# EAGLE design BreakoutChip (EAGLE 7.1.0)

## Sheet 1 of 4
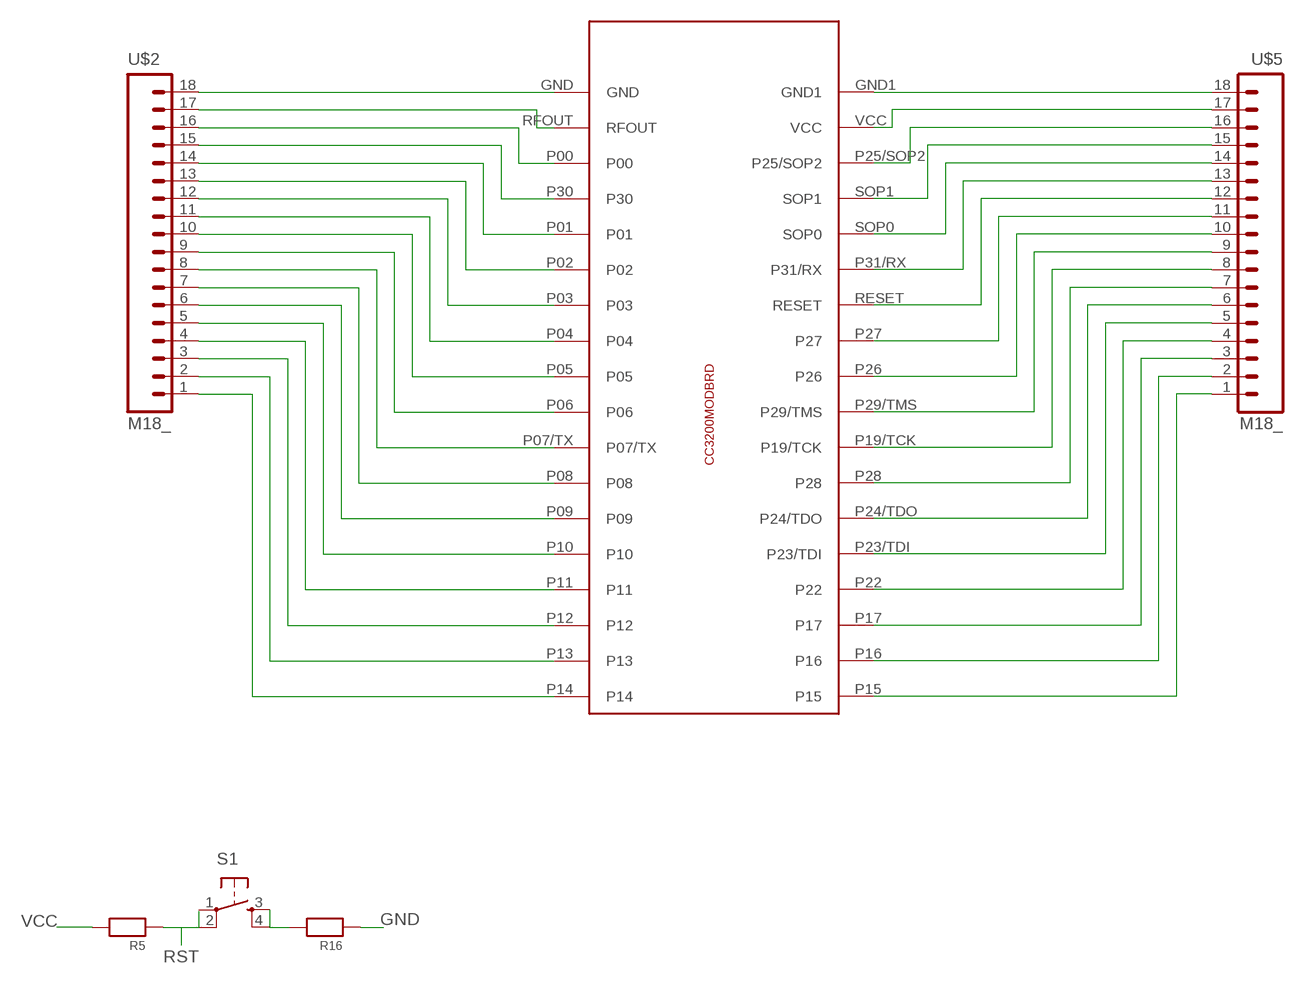
[diagram p0: schematic, sheet 1]

### Parts
R5  RESISTOR0402  [0402]
R16  RESISTOR0402  [0402]
S1  TAC_SWITCHSMD  [TACTILE_SWITCH_SMD]
U$1  CC3200MOD  [CC3200MOD]
U$2  M18_  [1X18]
U$5  M18_  [1X18]

### Nets
FTDI_RX: U$1.P01 U$2.14 ; also sheet 4
FTDI_TX: U$1.P02 U$2.13 ; also sheet 4
GND [vcc]: R16.1 U$1.GND U$1.GND1 U$2.18 U$5.18 ; also sheet 2,3,4
GPIO_05: U$1.P05 U$2.10 ; also sheet 2
N$1: R16.2 S1.3 S1.4
N$3: U$1.RFOUT U$2.17
N$4: U$1.P00 U$2.16
N$5: U$1.P30 U$2.15
N$9: U$1.P03 U$2.12
N$10: U$1.P04 U$2.11
N$13: U$1.P06 U$2.9
N$14: U$1.P07/TX U$2.8
N$15: U$1.P08 U$2.7
N$16: U$1.P09 U$2.6
N$17: U$1.P10 U$2.5
N$18: U$1.P11 U$2.4
N$19: U$1.P12 U$2.3
N$20: U$1.P13 U$2.2
N$21: U$1.P14 U$2.1
N$25: U$1.SOP1 U$5.15
N$26: U$1.SOP0 U$5.14
N$27: U$1.P31/RX U$5.13
N$29: U$1.P27 U$5.11
N$30: U$1.P26 U$5.10
N$31: U$1.P29/TMS U$5.9
N$32: U$1.P19/TCK U$5.8
N$33: U$1.P28 U$5.7
N$34: U$1.P24/TDO U$5.6
N$35: U$1.P23/TDI U$5.5
N$36: U$1.P22 U$5.4
N$37: U$1.P17 U$5.3
N$52: U$1.P16 U$5.2
N$53: U$1.P15 U$5.1
RST: R5.1 S1.2 U$1.RESET U$5.12 ; also sheet 4
SOP2: U$1.P25/SOP2 U$5.16 ; also sheet 4
VCC: R5.2 U$1.VCC U$5.17 ; also sheet 3,4
Unconnected: S1.1

## Sheet 2 of 4
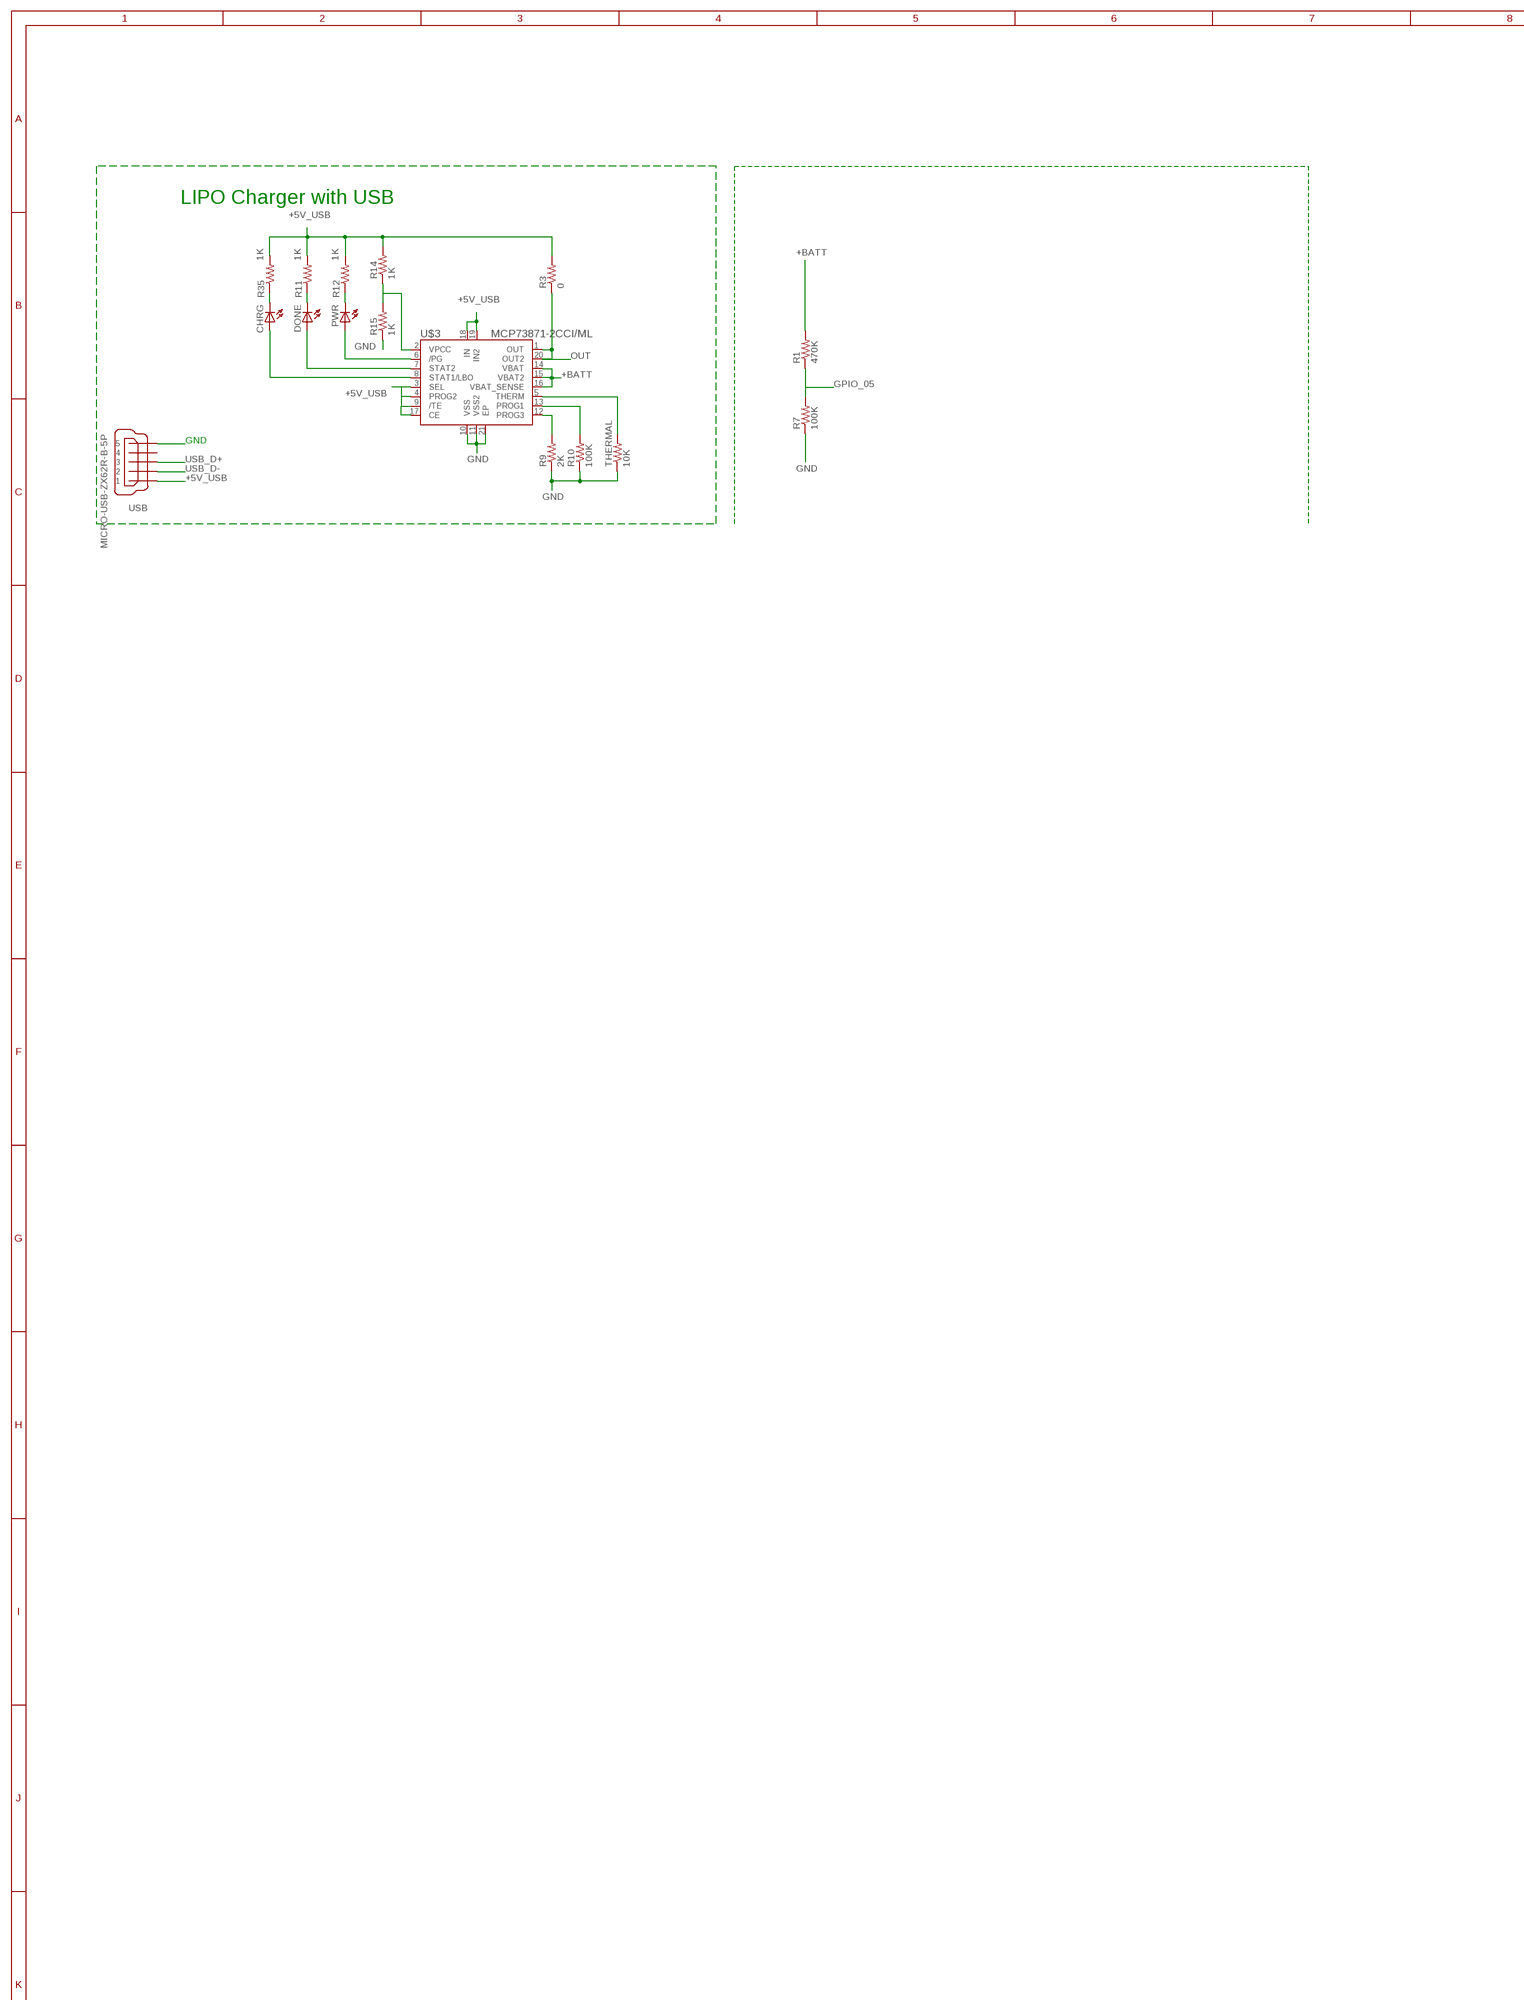
[diagram p1: schematic, sheet 2, part 1 of 3]
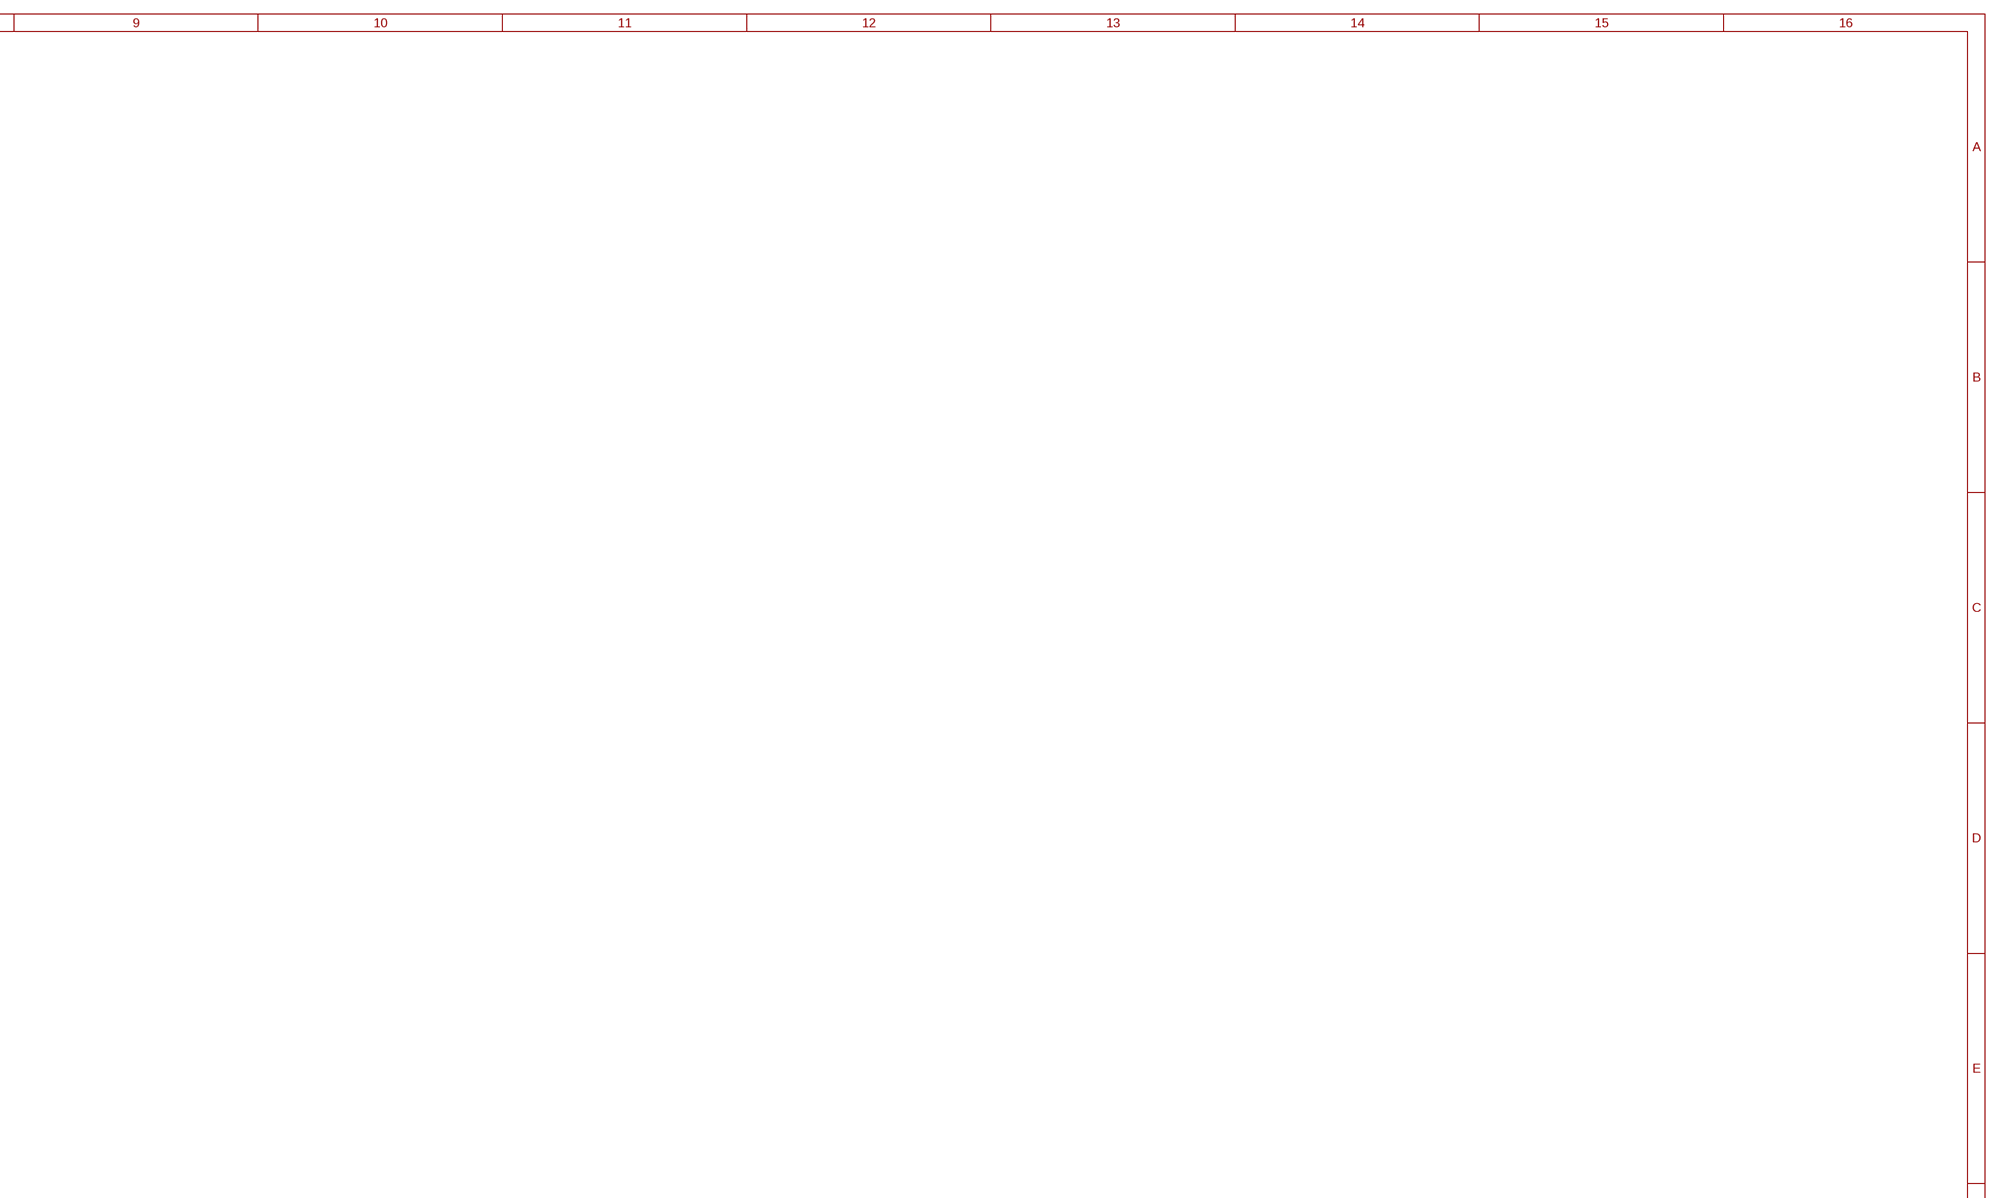
[diagram p2: schematic, sheet 2, part 2 of 3]
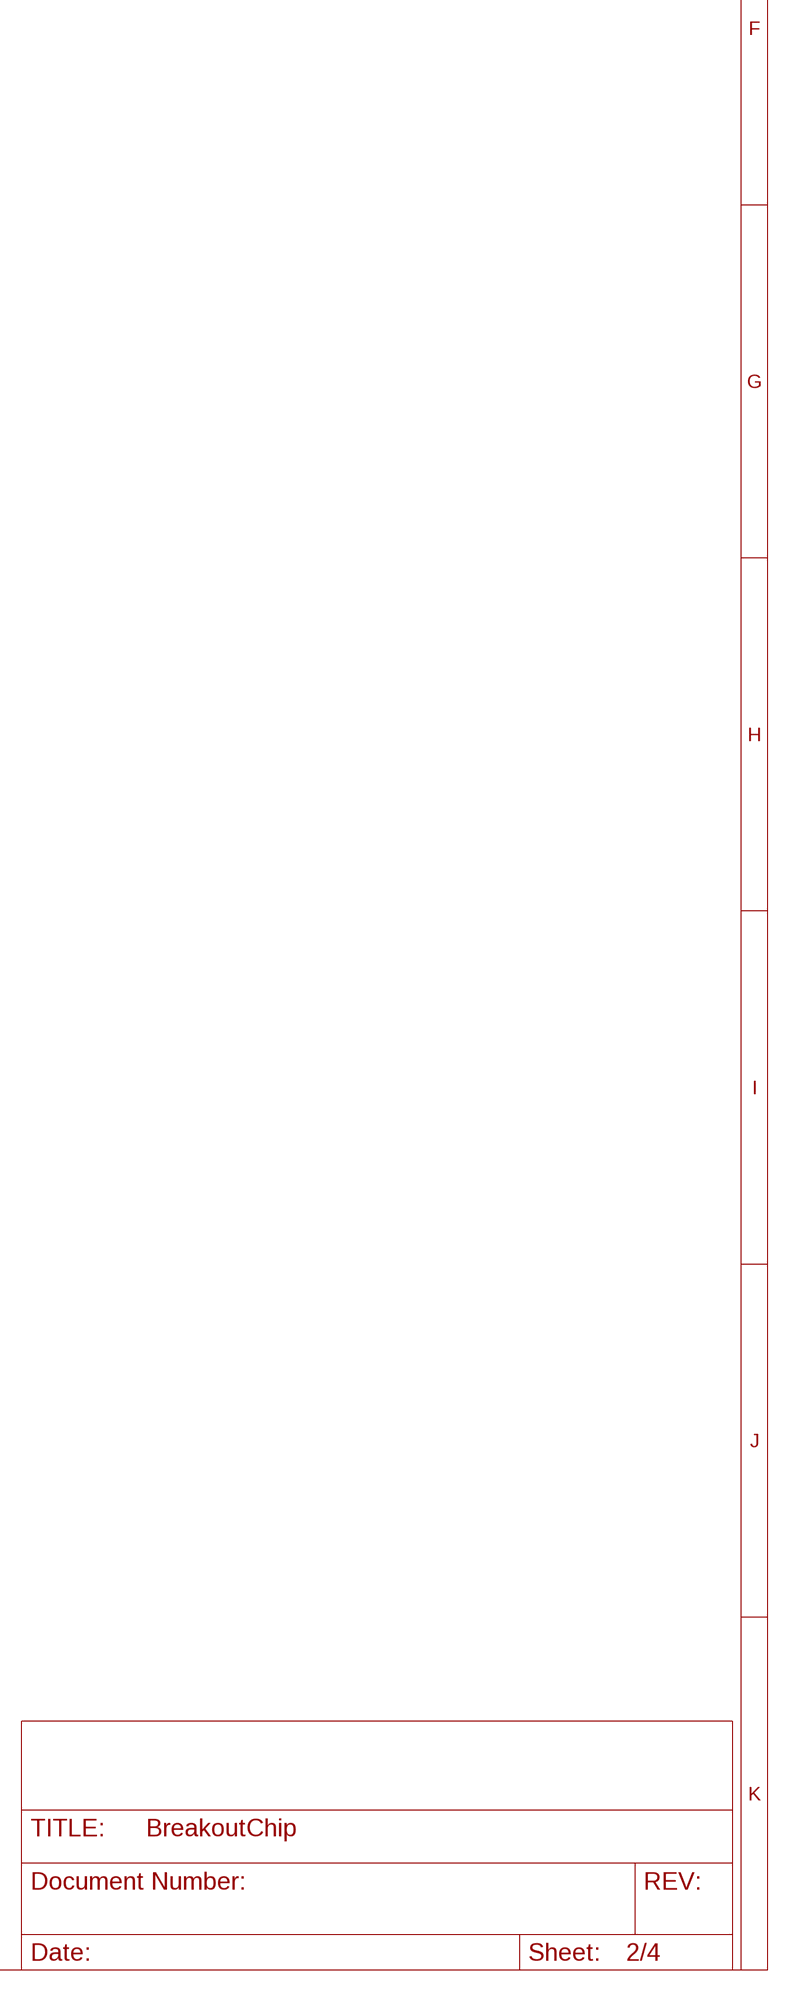
[diagram p3: schematic, sheet 2, part 3 of 3]

### Parts
CHRG  LEDSML0603  [SML0603]
DONE  LEDSML0603  [SML0603]
PWR  LEDSML0603  [SML0603]
R1  470K  RESISTOR0603  [0603-RES]
R3  0  RESISTOR0603-RES  [0603-RES]
R7  100K  RESISTOR0603  [0603-RES]
R9  2K  RESISTOR0603-RES  [0603-RES]
R10  100K  RESISTOR0603-RES  [0603-RES]
R11  1K  RESISTOR0402-RES  [0402-RES]
R12  1K  RESISTOR0402-RES  [0402-RES]
R14  1K  RESISTOR0603-RES  [0603-RES]
R15  1K  RESISTOR0603-RES  [0603-RES]
R35  1K  RESISTOR0402-RES  [0402-RES]
THERMAL  10K  RESISTOR0603-RES  [0603-RES]
U$3  MCP73871-2CCI/ML  [QFN20-4X4]
USB  MICRO-USB-ZX62R-B-5P  [ZX62R-B-5P]

### Nets
+5V_USB: R3.2 R11.2 R12.2 R14.2 R35.2 U$3.3(SEL) U$3.4(PROG2) U$3.9(/TE) U$3.17(CE) U$3.18(IN) U$3.19(IN2) USB.1 ; also sheet 4
+BATT: R1.2 U$3.14(VBAT) U$3.15(VBAT2) U$3.16(VBAT_SENSE) ; also sheet 3
GND [vcc]: R7.1 R9.1 R10.1 R15.1 THERMAL.1 U$3.10(VSS) U$3.11(VSS2) U$3.21(EP) USB.5 ; also sheet 1,3,4
GPIO_05: R1.1 R7.2 ; also sheet 1
N$68: R9.2 U$3.12(PROG3)
N$69: R10.2 U$3.13(PROG1)
N$70: PWR.A U$3.6(/PG)
N$71: DONE.A U$3.7(STAT2)
N$72: CHRG.A U$3.8(STAT1/LBO)
N$73: CHRG.C R35.1
N$74: DONE.C R11.1
N$75: PWR.C R12.1
N$76: R14.1 R15.2 U$3.2(VPCC)
N$77: THERMAL.2 U$3.5(THERM)
OUT: R3.1 U$3.1(OUT) U$3.20(OUT2) ; also sheet 3
USB_D+: USB.3 ; also sheet 4
USB_D-: USB.2 ; also sheet 4
Unconnected: USB.4

### Notes on the sheet
- LIPO Charger with USB
- GND

## Sheet 3 of 4
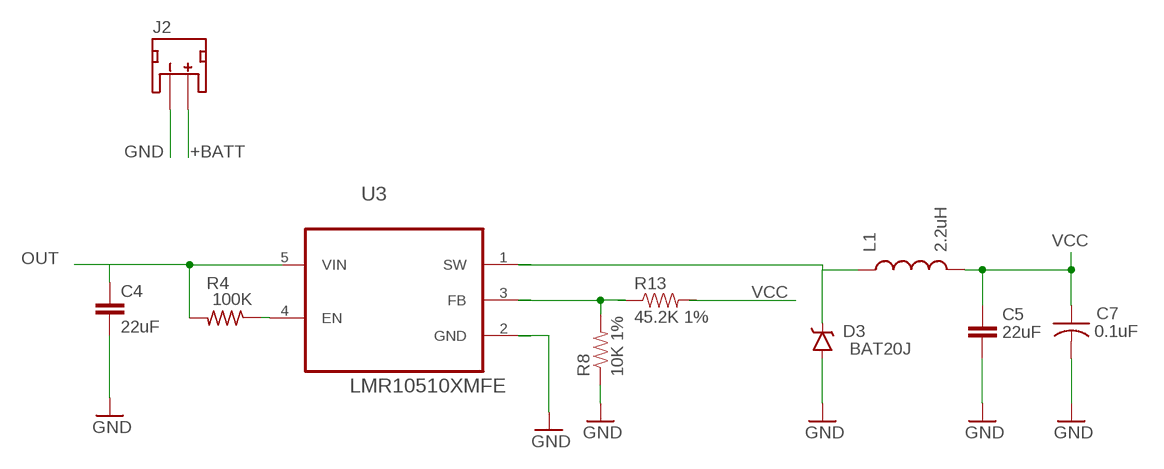
[diagram p4: schematic, sheet 3]

### Parts
C4  22uF  C-EUC0603  [C0603]
C5  22uF  C-EUC0603  [C0603]
C7  0.1uF  C-USC0402  [C0402]
D3  BAT20J  DIODE-SCHOTTKY-BAT20J  [SOD-323]
J2  JST_2MM_MALE  [JST-2-SMD]
L1  2.2uH  INDUCTOR-SPARKFUN0805  [0805]
R4  100K  R-US_R0402  [R0402]
R8  10K 1%  RESISTOR0402-RES  [0402-RES]
R13  45.2K 1%  RESISTOR0402-RES  [0402-RES]
U3  LMR10510XMFE  [SOT95P270X145-5N]

### Nets
+BATT: J2.2(+) ; also sheet 2
FB: R8.2 R13.1 U3.3(FB)
GND [vcc]: C4.2 C5.2 C7.2 D3.A J2.1(-) R8.1 U3.2(GND) ; also sheet 1,2,4
N$11: R4.1 U3.4(EN)
OUT: C4.1 R4.2 U3.5(VIN) ; also sheet 2
SW: D3.C L1.1 U3.1(SW)
VCC: C5.1 C7.1 L1.2 R13.2 ; also sheet 1,4
Unconnected: J2.NC1(PAD1) J2.NC2(PAD2)

## Sheet 4 of 4
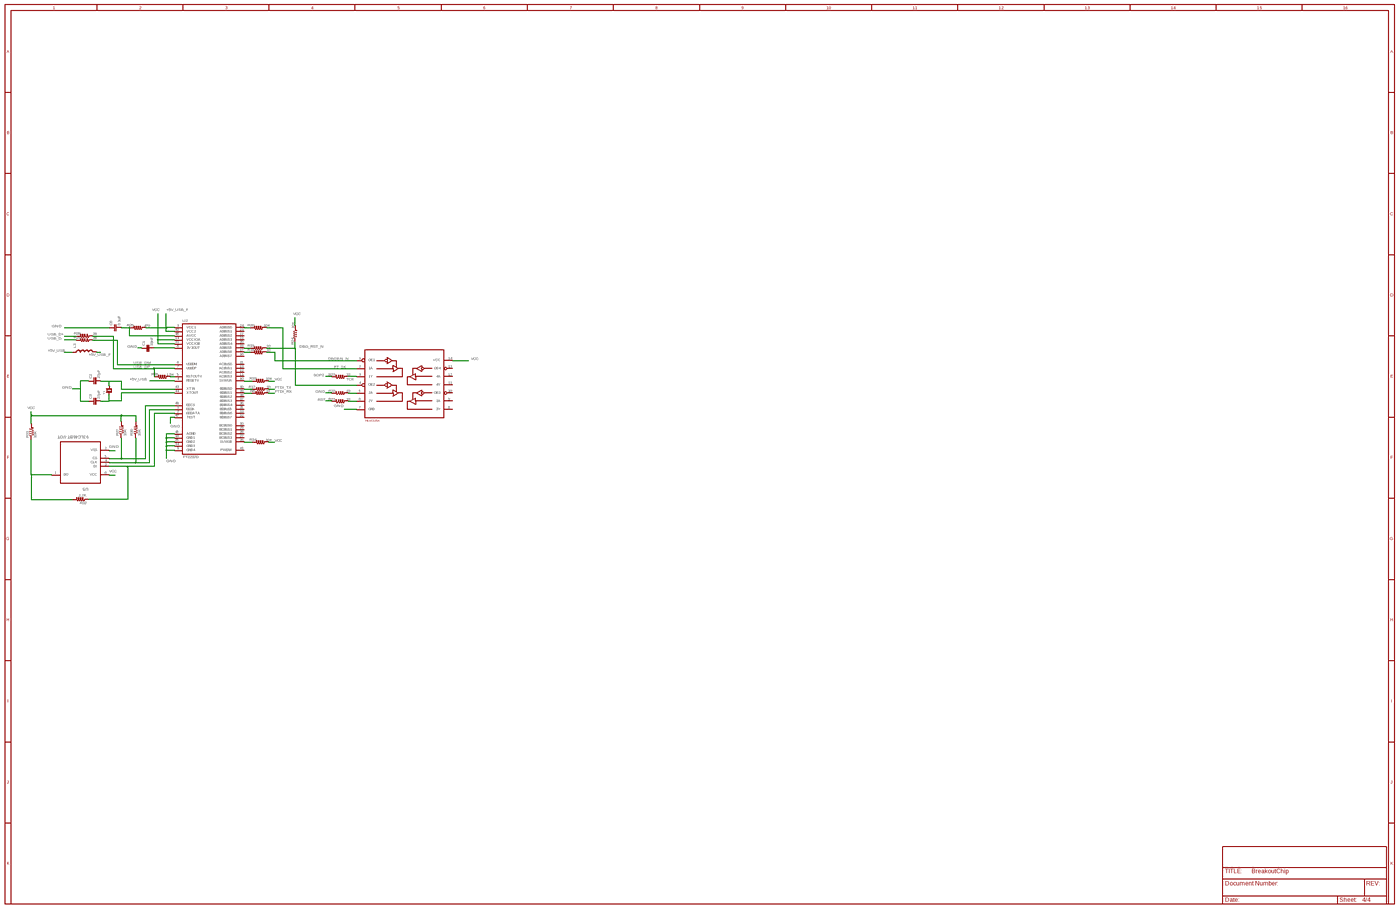
[diagram p5: schematic, sheet 4, overview]
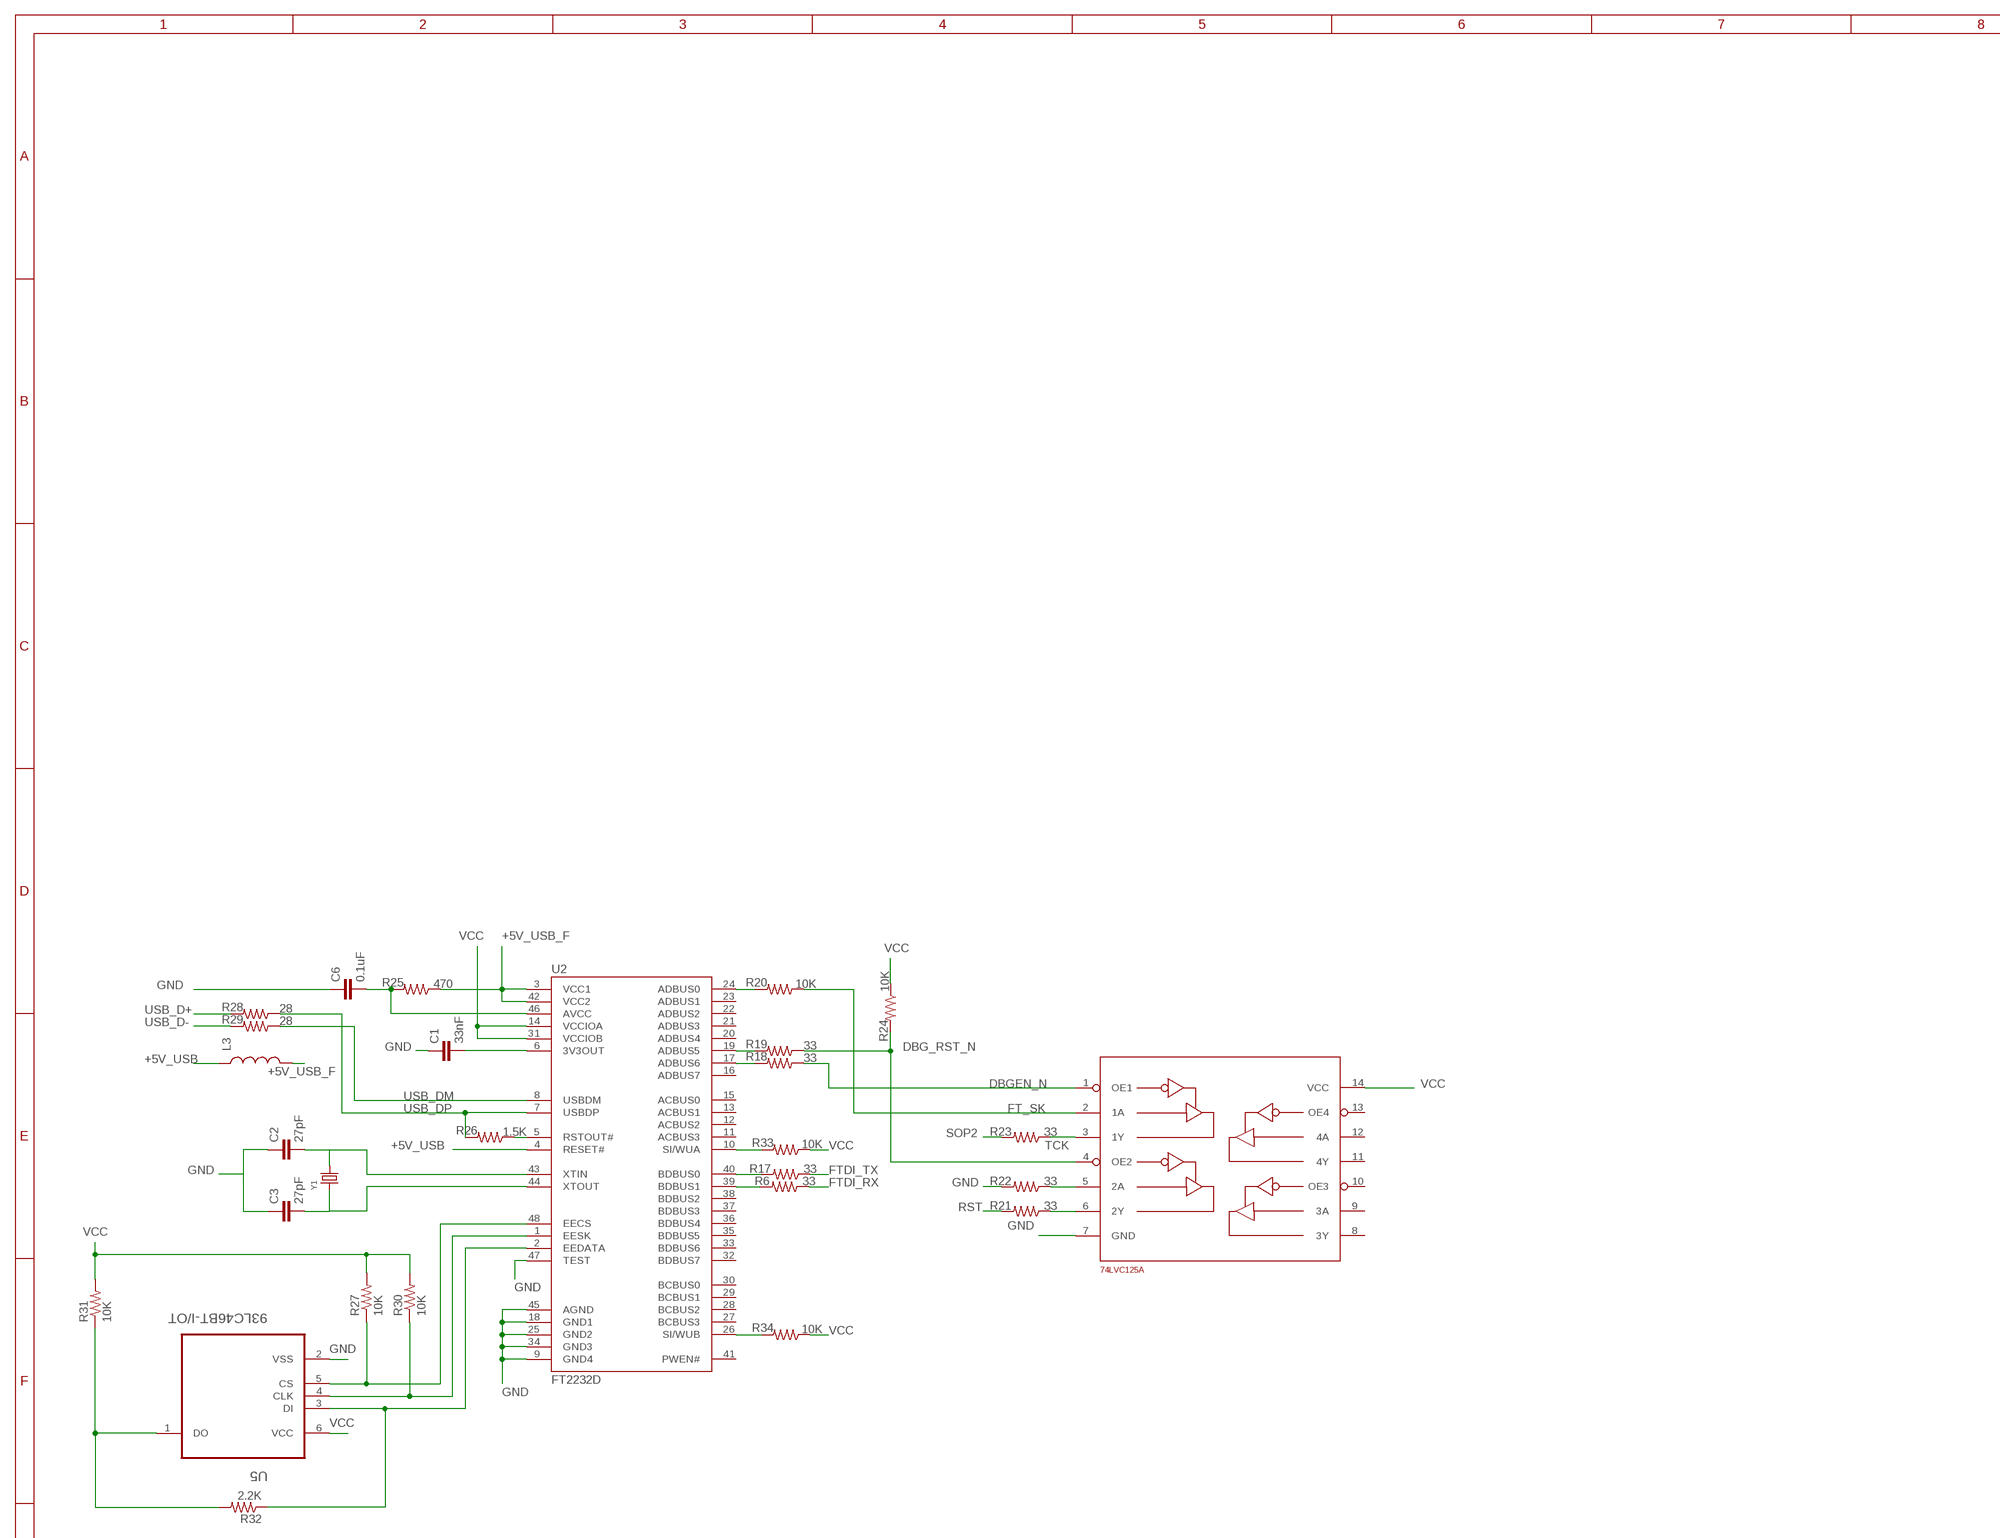
[diagram p6: schematic, sheet 4, part 1 of 4]
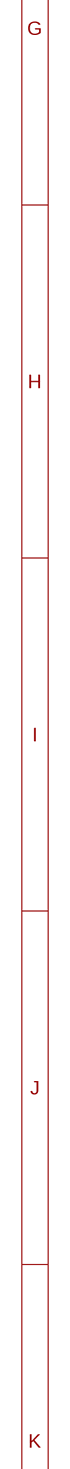
[diagram p7: schematic, sheet 4, part 2 of 4]
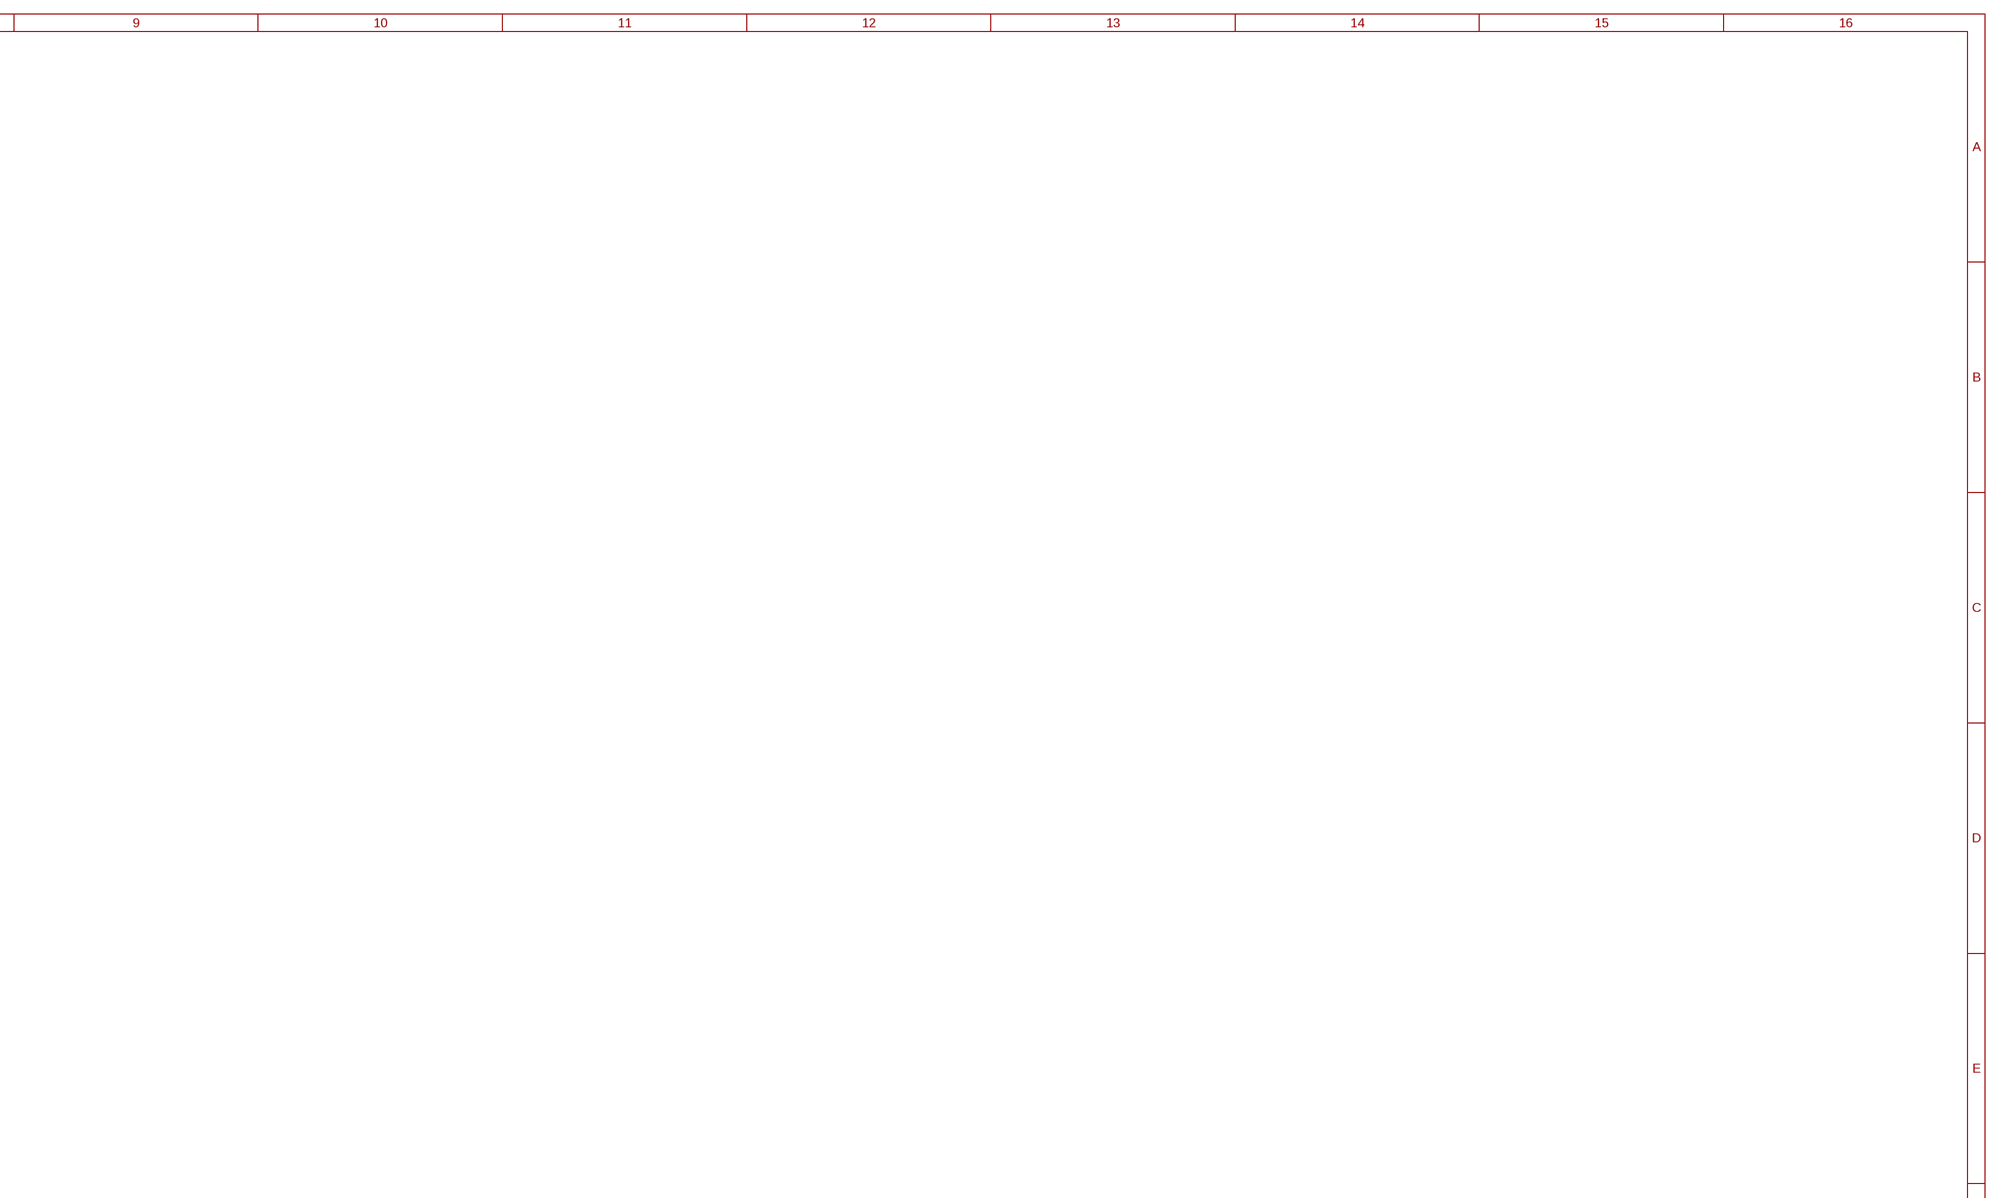
[diagram p8: schematic, sheet 4, part 3 of 4]
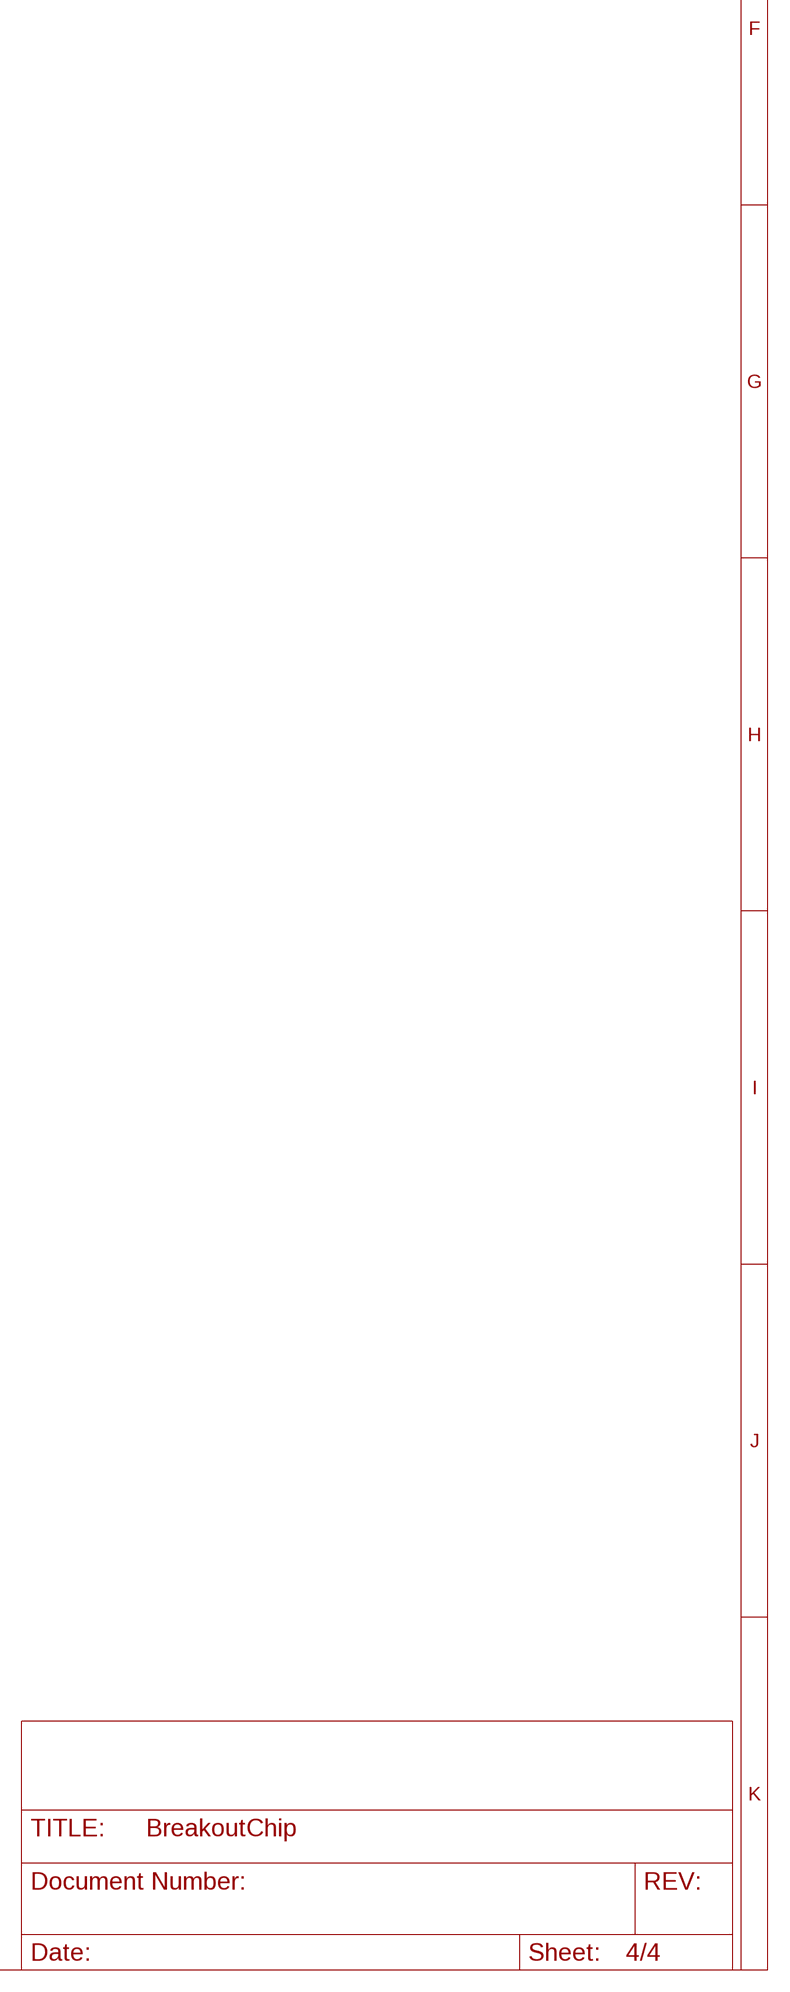
[diagram p9: schematic, sheet 4, part 4 of 4]

### Parts
C1  33nF  CAP0402-CAP  [0402-CAP]
C2  27pF  CAP0402-CAP  [0402-CAP]
C3  27pF  CAP0402-CAP  [0402-CAP]
C6  0.1uF  CAP0402-CAP  [0402-CAP]
L3  INDUCTOR-SPARKFUN0603  [0603]
R6  33  RESISTOR0402-RES  [0402-RES]
R17  33  RESISTOR0402-RES  [0402-RES]
R18  33  RESISTOR0402-RES  [0402-RES]
R19  33  RESISTOR0402-RES  [0402-RES]
R20  10K  RESISTOR0402-RES  [0402-RES]
R21  33  RESISTOR0402-RES  [0402-RES]
R22  33  RESISTOR0402-RES  [0402-RES]
R23  33  RESISTOR0402-RES  [0402-RES]
R24  10K  RESISTOR0402-RES  [0402-RES]
R25  470  RESISTOR0402-RES  [0402-RES]
R26  1.5K  RESISTOR0402-RES  [0402-RES]
R27  10K  RESISTOR0402-RES  [0402-RES]
R28  28  RESISTOR0402-RES  [0402-RES]
R29  28  RESISTOR0402-RES  [0402-RES]
R30  10K  RESISTOR0402-RES  [0402-RES]
R31  10K  RESISTOR0402-RES  [0402-RES]
R32  2.2K  RESISTOR0402-RES  [0402-RES]
R33  10K  RESISTOR0402-RES  [0402-RES]
R34  10K  RESISTOR0402-RES  [0402-RES]
U2  FT2232D  [LQFP-48]
U5  93LC46BT-I/OT  [SOT95P280X145-6N]
U$4  DECADE-74LVC125A  [DECADE-SO-14]
Y1  CRYSTAL2.5X2.0MM  [CRYSTAL_2.5X2]

### Nets
+5V_USB: L3.1 U2.4(RESET#) ; also sheet 2
+5V_USB_F: L3.2 R25.1 U2.3(VCC1) U2.42(VCC2)
DBG_RST_N: R19.1 R24.2 U$4.4(OE2)
DBGEN_N: R18.1 U$4.1(OE1)
FT_SK: R20.1 U$4.2(1A)
FTDI_RX: R6.1 ; also sheet 1
FTDI_TX: R17.1 ; also sheet 1
GND [vcc]: C1.1 C2.1 C3.1 C6.1 R22.2 U2.9(GND4) U2.18(GND1) U2.25(GND2) U2.34(GND3) U2.45(AGND) U2.47(TEST) U5.2(VSS) U$4.7(GND) ; also sheet 1,2,3
N$8: R26.1 U2.5(RSTOUT#)
N$38: C2.2 U2.43(XTIN) Y1.3
N$39: R27.1 U2.48(EECS) U5.5(CS)
N$40: C3.2 U2.44(XTOUT) Y1.1
N$41: R30.1 U2.1(EESK) U5.4(CLK)
N$42: R32.1 U2.2(EEDATA) U5.3(DI)
N$43: C1.2 U2.6(3V3OUT)
N$44: R17.2 U2.40(BDBUS0)
N$45: R6.2 U2.39(BDBUS1)
N$46: R20.2 U2.24(ADBUS0)
N$47: R19.2 U2.19(ADBUS5)
N$48: R18.2 U2.17(ADBUS6)
N$49: R22.1 U$4.5(2A)
N$50: R21.1 U$4.6(2Y)
N$51: C6.2 R25.2 U2.46(AVCC)
N$54: R31.1 R32.2 U5.1(DO)
N$55: R33.2 U2.10(SI/WUA)
N$56: R34.2 U2.26(SI/WUB)
RST: R21.2 ; also sheet 1
SOP2: R23.2 ; also sheet 1
TCK: R23.1 U$4.3(1Y)
USB_D+: R28.2 ; also sheet 2
USB_D-: R29.2 ; also sheet 2
USB_DM: R29.1 U2.8(USBDM)
USB_DP: R26.2 R28.1 U2.7(USBDP)
VCC: R24.1 R27.2 R30.2 R31.2 R33.1 U2.14(VCCIOA) U2.31(VCCIOB) U5.6(VCC) U$4.14(VCC) ; also sheet 1,3
Unconnected: R34.1 U2.11(ACBUS3) U2.12(ACBUS2) U2.13(ACBUS1) U2.15(ACBUS0) U2.16(ADBUS7) U2.20(ADBUS4) U2.21(ADBUS3) U2.22(ADBUS2) U2.23(ADBUS1) U2.27(BCBUS3) U2.28(BCBUS2) U2.29(BCBUS1) U2.30(BCBUS0) U2.32(BDBUS7) U2.33(BDBUS6) U2.35(BDBUS5) U2.36(BDBUS4) U2.37(BDBUS3) U2.38(BDBUS2) U2.41(PWEN#) U$4.8(3Y) U$4.9(3A) U$4.10(OE3) U$4.11(4Y) U$4.12(4A) U$4.13(OE4)

## Library data of the parts
C1-C3 C6 = SparkFun-Passives:CAP: Capacitor Standard 0603 ceramic capacitor, and 0.1" leaded capacitor.
C4 C5 = rcl:C-EU: CAPACITOR, European symbol
C7 = adafruit:C-US: CAPACITOR, American symbol
CHRG DONE PWR = led:LED: LED OSRAM: - CHIPLED LG R971, LG N971, LY N971, LG Q971, LY Q971, LO R971, LY R971 LH N974, LH R974 LS Q976, LO Q976, LY Q976 LO Q996 - Hyper CHIPLED LW Q18S LB Q993, LB Q99A, LB R99A - SideLED LS A670, LO A670, LY A670, LG A670, LP A670 LB A673, LV A673, LT A673, LW A673 LH A674 LY A675 LS A676, LA A676, LO A676, LY A676, LW A676 LS A679, LY A679, LG A679 - Hyper Micro SIDELED® LS Y876, LA Y876, LO Y876, LY Y876 LT Y87S - SmartLED LW L88C, LW L88S LB L89C, LB L89S, LG L890 LS L89K, LO L89K, LY L89K LS L896, LA L896, LO L896, LY L896 - TOPLED LS T670, LO T670, LY T670, LG T670, LP T670 LSG T670, LSP T670, LSY T670, LOP T670, LYG T670 LG T671, LOG T671, LSG T671 LB T673, LV T673, LT T673, LW T673 LH T674 LS T676, LA T676, LO T676, LY T676, LB T676, LH T676, LSB T676, LW T676 LB T67C, LV T67C, LT T67C, LS T67K, LO T67K, LY T67K, LW E67C LS E67B, LA E67B, LO E67B, LY E67B, LB E67C, LV E67C, LT E67C LW T67C LS T679, LY T679, LG T679 LS T770, LO T770, LY T770, LG T770, LP T770 LB T773, LV T773, LT T773, LW T773 LH T774 LS E675, LA E675, LY E675, LS T675 LS T776, LA T776, LO T776, LY T776, LB T776 LHGB T686 LT T68C, LB T68C - Hyper Mini TOPLED® LB M676 - Mini TOPLED Santana® LG M470 LS M47K, LO M47K, LY M47K Source: http://www.osram.convergy.de LUXEON: - LUMILED® LXK2-PW12-R00, LXK2-PW12-S00, LXK2-PW14-U00, LXK2-PW14-V00 LXK2-PM12-R00, LXK2-PM12-S00, LXK2-PM14-U00 LXK2-PE12-Q00, LXK2-PE12-R00, LXK2-PE12-S00, LXK2-PE14-T00, LXK2-PE14-U00 LXK2-PB12-K00, LXK2-PB12-L00, LXK2-PB12-M00, LXK2-PB14-N00, LXK2-PB14-P00, LXK2-PB14-Q00 LXK2-PR12-L00, LXK2-PR12-M00, LXK2-PR14-Q00, LXK2-PR14-R00 LXK2-PD12-Q00, LXK2-PD12-R00, LXK2-PD12-S00 LXK2-PH12-R00, LXK2-PH12-S00 LXK2-PL12-P00, LXK2-PL12-Q00, LXK2-PL12-R00 Source: www.luxeon.com KINGBRIGHT: KA-3528ASYC Source: www.kingbright.com
D3 = SparkFun-DiscreteSemi:DIODE-SCHOTTKY: Schottky diodes in SFE's production catalog BAT20J 1A 23V 0.62Vf RB751 120mA 40V 0.37Vf PMEG4005EJ 0.5A 40V 0.42Vf MBRA140 1A 40V 0.5Vf B340A 3A 40V SMA; PROD_ID: DIO-11623
J2 = SparkFun-Connectors:JST_2MM_MALE: Mates to single-cell LiPo batteries. CONN-08352; PROD_ID: CONN-08352
L1 L3 = Spark:INDUCTOR-SPARKFUN: Inductors Basic Inductor/Choke - 0603 and 1206. Footprints are not proven and vary greatly between part numbers. SRN6045- 33uH, 20% 1.4A
R1 R7 = SparkFun-Resistors:RESISTOR: Resistor Basic schematic elements and footprints for 0603, 1206, and PTH resistors.
R3 R6 R8-R15 R17-R35 THERMAL = SparkFun-Passives:RESISTOR: Resistor Basic schematic elements and footprints for 0603, 1206, and PTH resistors.
R4 = adafruit:R-US_: RESISTOR, American symbol
R5 R16 = microbuilder:RESISTOR: Resistors 0402 - 0402 Surface Mount Package 22 Ohm 1% 1/16W [Digikey: 311-22.0LRTR-ND] 33 Ohm 5% 1/16W 1.0K 5% 1/16W 1.5K 5% 1/16W 2.0K 1% 1/16W 10.0K 1% 1/16W [Digikey: 311-10.0KLRTR-ND] 10.0K 5% 1/16W [Digikey: RMCF0402JT10K0TR-ND] 12.1K 1% 1/16W [Digikey: 311-22.0LRTR-ND] 100.0K 5% 1/16W 0603 - 0603 Surface Mount Package 0 Ohm 1/10 Watt 1% Resistor 15 Ohm 1/10 Watt 1% Resistor 33 Ohm 1/10 Watt 1% Resistor 49.9 Ohm 1/10 Watt 1% Resistor 100 Ohm 1/10 Watt 1% Resistor 150 Ohm 1/10 Watt 1% Resistor 240 Ohm 1/10 Watt 1% Resistor 390 Ohm 1/10 Watt 1% Resistor 560 Ohm 1/10 Watt 1% Resistor 680 Ohm 1/10 Watt 1% Resistor 750 Ohm 1/10 Watt 1% Resistor 1.0K Ohm 1/10 Watt 1% Resistor 1.5K Ohm 1/10 Watt 1% Resistor 2.0K Ohm 1/10 Watt 1% Resistor 2.2K Ohm 1/10 Watt 1% Resistor 3.3K Ohm 1/10 Watt 1% Resistor 4.7K Ohm 1/10 Watt 1% Resistor 10.0K Ohm 1/10 Watt 1% Resistor 12.0K Ohm 1/10 Watt 1% Resistor 12.1K Ohm 1/10 Watt 1% Resistor 20.0K Ohm 1/10 Watt 1% Resistor 33.0K Ohm 1/10 Watt 1% Resistor 100.0K Ohm 1/10 Watt 1% Resistor 0805 - 0805 Surface Mount Package 0 Ohm 1/8 Watt 1% Resistor 33 Ohm 1/8 Watt 1% Resistor 100 Ohm 1/8 Watt 1% Resistor 150 Ohm 1/8 Watt 1% Resistor 200 Ohm 1/8 Watt 1% Resistor 240 Ohm 1/8 Watt 1% Resistor 330 Ohm 1/8 Watt 1% Resistor 390 Ohm 1/8 Watt 1% Resistor 470 Ohm 1/8 Watt 1% Resistor 1.0K Ohm 1/8 Watt 1% Resistor 1.5K Ohm 1/8 Watt 1% Resistor 2.0K Ohm 1/8 Watt 1% Resistor 4.7K Ohm 1/8 Watt 1% Resistor 5.1K Ohm 1/8 Watt 1% Resistor 5.6K Ohm 1/8 Watt 1% Resistor 10.0K Ohm 1/8 Watt 1% Resistor 22.0K Ohm 1/8 Watt 1% Resistor 33.0K Ohm 1/8 Watt 1% Resistor 100K Ohm 1/8 Watt 1% Resistor 1206 - 1206 Surface Mount Package 2012 - 2010 Surface Mount Package 0.11 Ohm 1/2 Watt 1% Resistor - Digikey: RHM.11UCT-ND
S1 = Spark:TAC_SWITCH: SMD Tactiile Switch
U2 = SparkFun-DigitalIC:FT2232D: USB to USART/FIFO/JTAG/SPI/I2C
U3 = Microchip_By_element14_Batch_1:LMR10510XMFE
U5 = Microchip_By_element14_Batch_1:93LC46BT-I/OT: 1K Microwire Compatible Serial EEPROM; MPN: 93LC46BT-I/OT; OC_FARNELL: 1556164; OC_NEWARK: 75M3689; PACKAGE: SOT-6; SUPPLIER: Microchip
U$1 = CC3200MODBRD:CC3200MOD
U$2 U$5 = DECADE-libraries:M18: 1x18 .1" header
U$3 = microchip-battery:MCP73871: Stand-Alone System Load Sharing and Li-Ion / Li-Polymer Battery Charge Managemen The MCP73871 device is a 1A fully integrated linear solution for system load sharing and Li-Ion / Li-Polymer battery charge management with AC-DC wall adapter and USB port power sources selection. It?s also capable of autonomous power source selection between input or battery. The MCP73871 device employs a constant current/constant voltage (CC/CV) charge algorithm with selectable charge termination point. The constant voltage regulation is fixed with four available options: 4.10V, 4.20V, 4.35V, or 4.40V.; LBO: 3.1 V; SAFETYTIMER: 6 Hours; VREG: 4.20V
U$4 = DECADE-libraries:DECADE-74LVC125A
USB = con-hirose:MICRO-USB-: Hirose Micro USB Connector ZX62R-B-5P: Micro B, reverse (top mount) shell SMT Supplier: DigiKey H11574CT-ND Source: http://www.hirose.co.jp/cataloge_hp/e24200011.pdf
Y1 = microbuilder:CRYSTAL: Crystals HC49UP - Surface Mount Crystal 4.0MHz 18pF +/-30ppm Surface Mount Crystal [Digikey: 535-9857-1-ND] 12.0 MHz Surface Mount Crystal [Digikey: 535-9869-6-ND] 25.0 MHz Surface Mount Crystal [Digikey: 535-9078-1-ND] 2.5 x 2.0mm - MEMs SMT Crystal 16.0 MHz 10pF 20ppm 2.5 x 2.0mm Crystal [Digikey -40-85°C: 535-10923-1-ND] 3.2 x 2.5mm - MEMs SMT Crystal 12.0 MHz 8pF 15ppm 3.2 x 2.5mm Crystal [Digikey: -10-70°C: 644-1047-1-ND -40-125°C: 644-1128-1-ND] 16.0 MHz 8pF 15ppm 3.2 x 2.5mm Crystal [Digikey: -10-70°C: 644-1049-1-ND -40-125°C: 644-1129-2-ND] 16.0 MHz 10pF 10ppm 3.2 x 2.5mm Crystal [Digikey: 644-1100-1-ND] 27.12 MHz 18pF 30ppm 3.2 x 2.5mm Crystal [Digikey: 887-1424-1-ND] 27.12MHz 10pF 10ppm 3.2 x 2.5mm Crystal [Digikey: 887-1329-1-ND] 4.9 x 1.8mm - MEMs SMT Crystal 32.768 KHz 12.5pF 20ppm 4.9 x 1.8mm Crystal [Digikey: SE2415CT-ND] 8.0 x 3.8mm - Surface Mount Crystal 32.768kHz 12.5pF 20ppm -40°C-85°C [Digikey: 535-9166-2-ND] Cylinder 32.768KHz Cylinder Crystal (2x6mm body) [Ex. Digikey: 300-8341-2-ND]

## Board
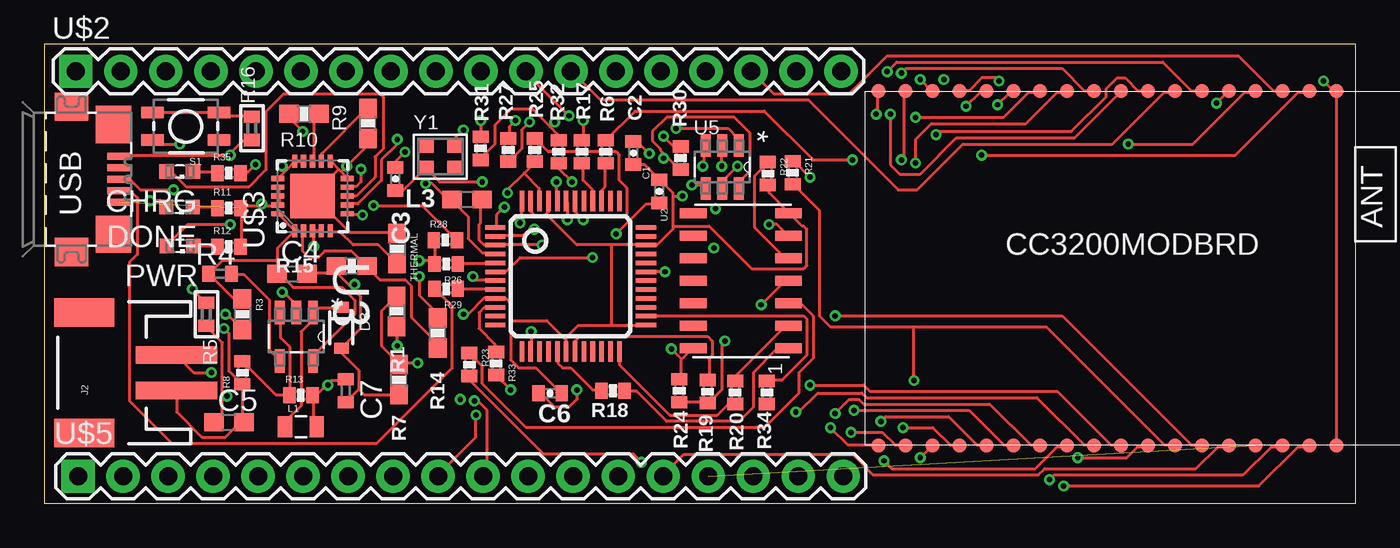
[diagram p10: board, top side]
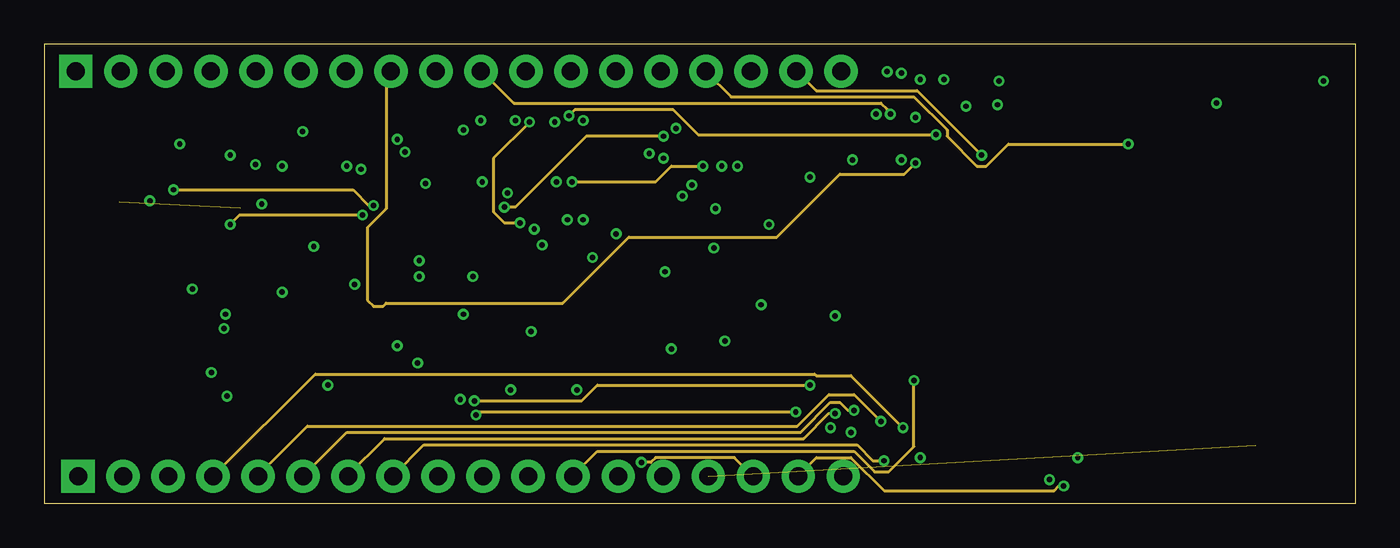
[diagram p11: board, inner layer Route2]
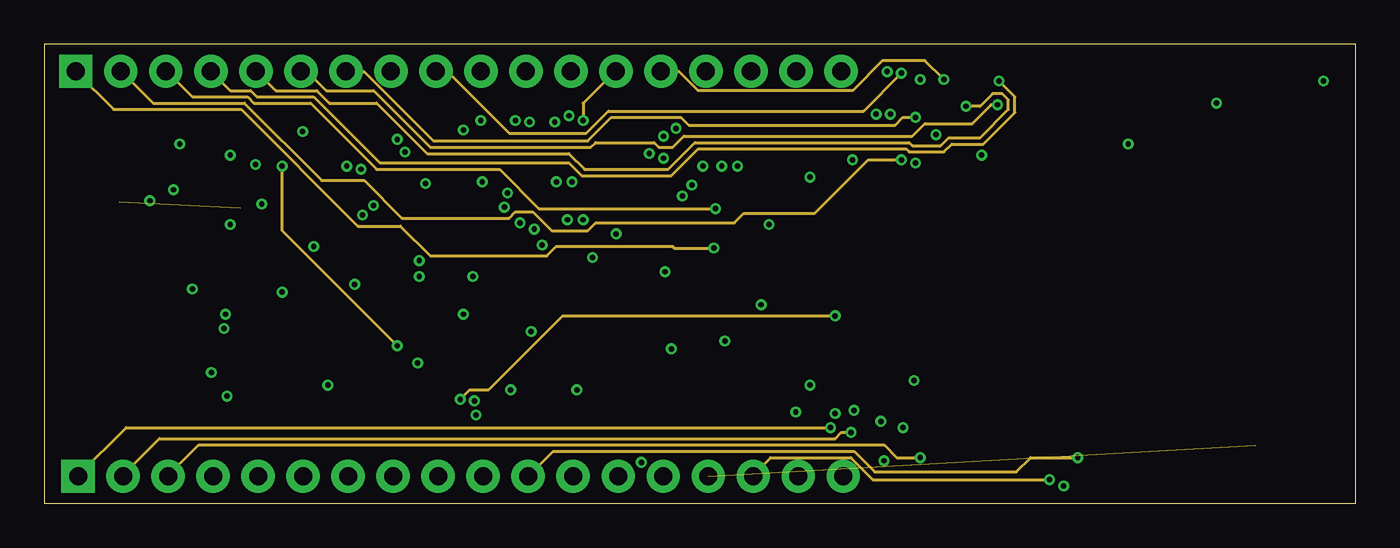
[diagram p12: board, inner layer Route15]
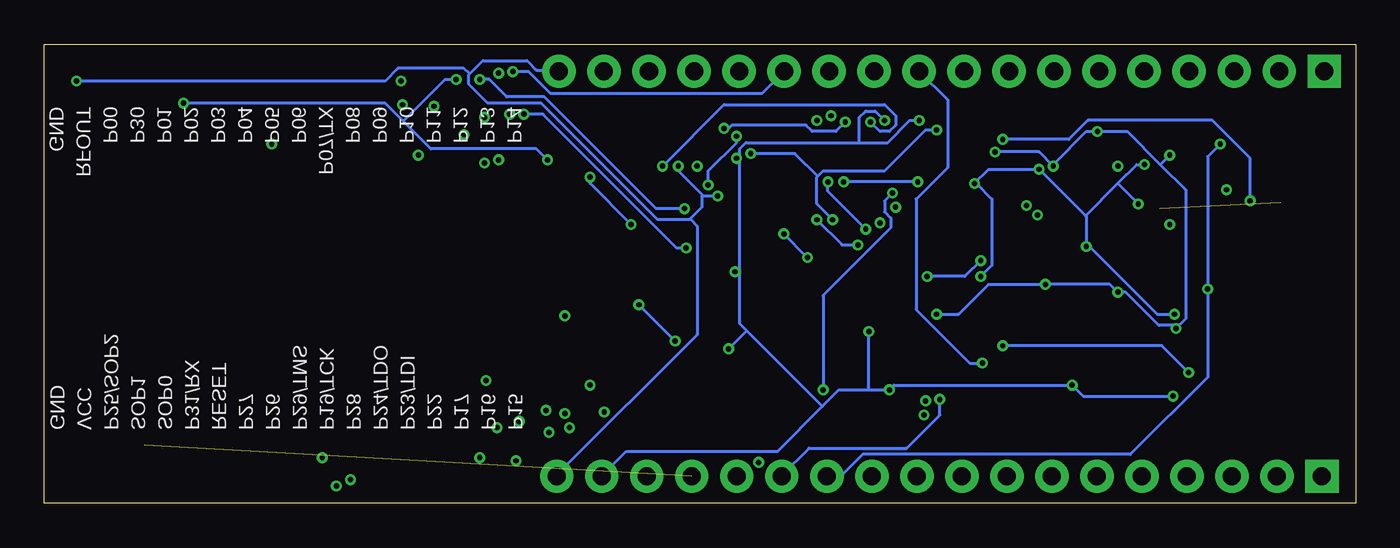
[diagram p13: board, bottom side, seen from below]

Size 74 x 25.9 mm. Coordinates in mm from the lower left corner, seen from the top.
Outline: 0,0 74,0 74,25.9 0,25.9 0,0
Copper layers (1*2*15*16): Top 0.035mm / dielectric 1.5mm / Route2 0.035mm / dielectric 0.15mm / Route15 0.035mm / dielectric 0.2mm / Bottom 0.035mm
Design rules "SmartEagleRules *": minimum track width 7mil, minimum drill 12mil, track to track 7mil, track to pad 7mil, pad to pad 7mil, via to via 7mil, smd to smd 0mil, copper to edge 20mil, drill to drill 10mil, minimum pad ring 10mil, minimum via ring 6mil, stop-mask expansion 2mil, vias tented up to drill 25mil, thermal gap 10mil

### Footprints (pad centres in the part's own frame; a part is rotated, then mirrored left to right if it is on the bottom)
0402-CAP = smd 0.7 x 0.9: 1 -0.65,0; 2 0.65,0
C0603 = smd 1.1 x 1: 1 -0.85,0; 2 0.85,0
C0402 = smd 0.7 x 0.9: 1 -0.65,0; 2 0.65,0
SML0603 = smd 0.8 x 0.8: A 0.75,0; C -0.75,0
SOD-323 = smd 0.63 x 0.83: A 1.15,0; C -1.15,0
JST-2-SMD = smd 1 x 4.6: 1 -1,-3.7; 2 1,-3.7 | smd 1.6 x 3.4: NC1 -3.4,1.5; NC2 3.4,1.5
0805 = smd 0.8 x 1.2: 1 -0.9,0; 2 0.9,0
0603 = smd 1.1 x 1: 1 -0.85,0; 2 0.85,0
0603-RES = smd 1.1 x 1: 1 -0.85,0; 2 0.85,0
R0402 = smd 0.7 x 0.9: 1 -0.65,0; 2 0.65,0
0402 = smd 0.7 x 0.9: 1 -0.65,0; 2 0.65,0
0402-RES = smd 0.7 x 0.9: 1 -0.65,0; 2 0.65,0
TACTILE_SWITCH_SMD = smd 1.25 x 0.65: 1 -1.875,0.775; 2 1.875,0.775; 3 -1.875,-0.775; 4 1.875,-0.775
LQFP-48 = smd 0.254 x 1.143: 1 -2.75,-4.25; 2 -2.25,-4.25; 3 -1.75,-4.25; 4 -1.25,-4.25; 5 -0.75,-4.25; 6 -0.25,-4.25; 7 0.25,-4.25; 8 0.75,-4.25; 9 1.25,-4.25; 10 1.75,-4.25; 11 2.25,-4.25; 12 2.75,-4.25; 25 2.75,4.25; 26 2.25,4.25; 27 1.75,4.25; 28 1.25,4.25; 29 0.75,4.25; 30 0.25,4.25; 31 -0.25,4.25; 32 -0.75,4.25; 33 -1.25,4.25; 34 -1.75,4.25; 35 -2.25,4.25; 36 -2.75,4.25 | smd 1.143 x 0.254: 13 4.25,-2.75; 14 4.25,-2.25; 15 4.25,-1.75; 16 4.25,-1.25; 17 4.25,-0.75; 18 4.25,-0.25; 19 4.25,0.25; 20 4.25,0.75; 21 4.25,1.25; 22 4.25,1.75; 23 4.25,2.25; 24 4.25,2.75; 37 -4.25,2.75; 38 -4.25,2.25; 39 -4.25,1.75; 40 -4.25,1.25; 41 -4.25,0.75; 42 -4.25,0.25; 43 -4.25,-0.25; 44 -4.25,-0.75; 45 -4.25,-1.25; 46 -4.25,-1.75; 47 -4.25,-2.25; 48 -4.25,-2.75
SOT95P270X145-5N = smd 1.321 x 0.559: 1 -1.372,0.94; 2 -1.372,0; 3 -1.372,-0.94; 4 1.372,-0.94; 5 1.372,0.94
SOT95P280X145-6N = smd 1.27 x 0.559: 1 -1.219,0.94; 2 -1.219,0; 3 -1.219,-0.94; 4 1.219,-0.94; 5 1.219,0; 6 1.219,0.94
CC3200MOD = smd 0.8 x 0.8: GND 11.09,10; GND1 11.09,-10; P00 8.05,10; P01 5.01,10; P02 3.49,10; P03 1.97,10; P04 0.45,10; P05 -1.07,10; P06 -2.59,10; P07/TX -4.11,10; P08 -5.63,10; P09 -7.15,10; P10 -8.67,10; P11 -10.19,10; P12 -11.71,10; P13 -13.23,10; P14 -14.75,10; P15 -14.75,-10; P16 -13.23,-10; P17 -11.71,-10; P19/TCK -4.11,-10; P22 -10.19,-10; P23/TDI -8.67,-10; P24/TDO -7.15,-10; P25/SOP2 8.05,-10; P26 -1.07,-10; P27 0.45,-10; P28 -5.63,-10; P29/TMS -2.59,-10; P30 6.53,10; P31/RX 3.49,-10; RESET 1.97,-10; RFOUT 9.57,10; SOP0 5.01,-10; SOP1 6.53,-10; VCC 9.57,-10
1X18 = drill 1.016 pad 1.88 square: 1 0,0 | drill 1.016 pad 1.88: 2 2.54,0; 3 5.08,0; 4 7.62,0; 5 10.16,0; 6 12.7,0; 7 15.24,0; 8 17.78,0; 9 20.32,0; 10 22.86,0; 11 25.4,0; 12 27.94,0; 13 30.48,0; 14 33.02,0; 15 35.56,0; 16 38.1,0; 17 40.64,0; 18 43.18,0
QFN20-4X4 = smd 0.73 x 0.3: 1 -1.965,1; 2 -1.965,0.5; 3 -1.965,0; 4 -1.965,-0.5; 5 -1.965,-1; 11 1.965,-1; 12 1.965,-0.5; 13 1.965,0; 14 1.965,0.5; 15 1.965,1 | smd 0.3 x 0.73: 6 -1,-1.965; 7 -0.5,-1.965; 8 0,-1.965; 9 0.5,-1.965; 10 1,-1.965; 16 1,1.965; 17 0.5,1.965; 18 0,1.965; 19 -0.5,1.965; 20 -1,1.965 | smd 2.5 x 2.5: 21 0,0
DECADE-SO-14 = smd 0.55 x 1.5: 1 -3.6,-2.88; 2 -2.33,-2.88; 3 -1.06,-2.88; 4 0.21,-2.88; 5 1.48,-2.88; 6 2.75,-2.88; 7 4.02,-2.88; 8 4.02,2.5; 9 2.75,2.5; 10 1.48,2.5; 11 0.21,2.5; 12 -1.06,2.5; 13 -2.33,2.5; 14 -3.6,2.5
ZX62R-B-5P = smd 1.35 x 0.4: 1 2.675,-1.3; 2 2.675,-0.65; 3 2.675,0; 4 2.675,0.65; 5 2.675,1.3 | smd 1.9 x 1.6: M1 0,-4.1; M2 0,4.1 | smd 2 x 2.1: M3 2.35,3.1; M4 2.35,-3.1
CRYSTAL_2.5X2 = smd 0.9 x 0.8: 1 -0.825,-0.625; 2 0.825,-0.625; 3 0.825,0.625; 4 -0.825,0.625

### Placement (x,y rotation side)
C1  34.7,17.61 270 top
C2  33.24,19.77 90 top
C3  19.81,18.3 270 top
C4  13.97,12.95 0 top
C5  10.41,4.57 0 top
C6  28.55,6.21 180 top
C7  17.02,6.35 270 top
CHRG  7.64,18.72 180 top
D3  16.76,9.91 270 top
DONE  7.62,16.72 180 top
J2  3.76,7.37 90 top
L1  14.48,4.32 0 top
L3  23.86,17.14 0 top
PWR  7.66,14.52 180 top
R1  19.87,10.83 270 top
R3  11.18,10.67 270 top
R4  9.91,12.95 180 top
R5  9.14,10.67 270 top
R6  31.68,19.84 270 top
R7  20.02,6.98 90 top
R8  11.18,7.37 90 top
R9  18.26,21.43 90 top
R10  14.65,21.98 0 top
R11  10.41,16.66 0 top
R12  10.41,14.48 0 top
R13  14.48,6.1 0 top
R14  22.2,9.61 90 top
R15  17.35,13.39 0 top
R16  11.71,21.16 90 top
R17  30.33,19.84 270 top
R18  32.09,6.35 180 top
R19  37.43,6.3 90 top
R20  38.98,6.25 270 top
R21  42.23,18.65 270 top
R22  40.83,18.6 270 top
R23  23.99,7.83 270 top
R24  35.83,6.35 270 top
R25  27.67,19.94 270 top
R26  22.68,13.5 180 top
R27  26.18,19.94 90 top
R28  22.63,14.85 0 top
R29  22.68,12.1 180 top
R30  35.91,19.48 270 top
R31  24.62,20.03 90 top
R32  29.03,19.84 90 top
R33  25.5,7.89 90 top
R34  40.78,6.25 90 top
R35  10.41,18.63 0 top
S1  7.98,21.27 180 top
THERMAL  19.9,14.37 270 top
U2  29.7,12.81 270 top
U3  14.22,9.4 270 top
U5  38.26,18.97 270 top
U$1  61.83,13.26 0 top
U$2  1.78,24.38 0 top
U$3  15.13,17.34 90 top
U$4  39.12,12.34 90 top
U$5  1.9,1.52 0 top
USB  1.54,18.28 0 top
Y1  22.35,19.56 0 top

### Tracks (layer width: path | path; a pad name or v marks a point on that pad's centre or on a via)
+5V_USB  (via drill 0.3)  (1 unrouted)
  Top 0.178: U$3.17 13.25,17.78 13.25,17.42 U$3.18 13.25,17.34 13.25,16.89 U$3.19 13.16,16.8 12.27,16.8 | R12.2 11.11,14.49 11.11,16.62 R11.2 11.2,16.62 11.38,16.8 12.27,16.8 | U$3.4 15.56,15.38 15.2,15.38 U$3.3 15.2,15.29 v15.2,14.49 | v17.87,18.85 17.87,18.14 17.6,17.87 17.16,17.87 U$3.9 | v21.51,18.05 21.87,18.05 22.76,17.16 22.94,17.16 L3.1 23.02,17.07 23.91,16.18 23.91,14.94 24.71,14.13 25.43,14.13 U2.4 | v11.91,19.11 11.47,18.67 11.11,18.67 R35.2 | v10.22,10.67 10.31,10.67 11.11,9.87 R3.2 | v21.16,12.8 21.16,11.73 22.14,10.76 22.14,10.49 R14.2 | v12.27,16.89 12.27,16.8
  Bottom 0.178: 15.2,14.67 15.2,16.18 15.25,16.22 | 15.25,16.22 v17.87,18.85 20.71,18.85 v21.51,18.05 21.43,18.05 20.54,17.16 20.54,13.42 v21.16,12.8 | v11.91,19.11 12.36,19.11 13.42,18.05 | 15.25,16.22 13.42,18.05 | v10.22,10.67 11.2,10.67 15.2,14.67 | 15.2,14.67 v15.2,14.49 | 13.42,18.05 v12.27,16.89
+5V_USB_F  (via drill 0.3)
  Top 0.178: L3.2 24.62,17.07 24.62,15.82 24.54,15.73 24.54,14.85 24.8,14.58 25.43,14.58 U2.3 25.51,14.58 v28.09,14.58 | 30.4,16.18 30.23,16.18 29.96,16.45 29.96,16.98 U2.42 | 30.4,16.18 32.72,16.18 32.89,16.36 32.89,17.78 32.45,18.22 32.45,19.65 32.27,19.82 28.45,19.82 27.74,20.54 R25.1 | 30.4,16.18 v30.4,16
  Bottom 0.178: v28.09,14.58 28.98,14.58 v30.4,16
+BATT  (via drill 0.3)
  Top 0.178: 13.65,18.8 U$3.15 14.22,19.29 14.58,19.29 U$3.14 | 13.65,18.8 13.25,18.4 U$3.16 | v19.91,8.89 19.91,9.96 R1.2 | v9.42,7.38 8.45,7.38 7.47,8.36 J2.2 | v13.42,19.02 13.65,18.8
  Route15 0.178: v13.42,19.02 13.42,15.38 v19.91,8.89
  Bottom 0.178: v19.91,8.89 10.94,8.89 v9.42,7.38
DBG_RST_N  (via drill 0.3)
  Top 0.178: R24.2 35.92,5.69 37.43,5.69 R19.1 37.52,5.69 38.23,6.4 38.23,8.98 v38.41,9.16 | v40.45,11.2 41.78,12.54 41.96,12.54 U$4.4
  Bottom 0.178: v40.45,11.2 v38.41,9.16
DBGEN_N
  Top 0.178: R18.1 32.8,6.31 33.43,6.31 35.12,4.62 39.2,4.62 40.01,5.42 40.01,7.38 41.34,8.71 41.96,8.71 U$4.1
FB
  Top 0.178: R8.2 11.2,8 13.07,6.13 13.78,6.13 R13.1 13.87,6.13 13.87,8.8 13.34,9.34 13.34,10.76 U3.3
FT_SK
  Top 0.178: R20.1 39.03,6.93 39.03,7.2 41.78,9.96 41.96,9.96 U$4.2
FTDI_RX  (via drill 0.3)
  Top 0.178: v66.14,22.58 66.76,23.2 U$1.P01 | v45.61,19.38 43.38,19.38 40.63,22.14 33.34,22.14 31.74,20.54 R6.1
  Route15 0.178: v50.76,23.91 49.7,24.98 47.3,24.98 45.61,23.29 36.89,23.29 35.83,24.36 34.85,24.36 U$2.14
  Bottom 0.178: v66.14,22.58 54.76,22.58 53.74,21.56 | 53.74,21.56 52.18,20 46.23,20 v45.61,19.38 | v50.76,23.91 51.38,23.91 53.74,21.56
FTDI_TX  (via drill 0.3)
  Top 0.178: v47.56,24.36 48.09,24.89 63.12,24.89 64.72,23.29 65.25,23.29 U$1.P02 | v30.4,21.6 30.4,20.54 R17.1
  Route15 0.178: v30.4,21.6 30.4,22.58 32.18,24.36 U$2.13
  Bottom 0.178: v47.56,24.36 46.67,24.36 45.43,23.11 33.52,23.11 32.27,24.36 U$2.13
GND  (via drill 0.3)
  Top 0.178: C4.2 14.85,12.98 16.09,12.98 16.45,13.34 R15.1 16.36,13.16 17.29,12.22 | 17.74,6.45 17.07,5.78 C7.2 | 17.74,6.45 17.78,6.49 17.78,7.47 16.8,8.45 16.8,8.71 D3.A 16.8,8.8 17.87,9.87 17.87,11.65 17.29,12.22 | 17.74,6.45 18.05,6.13 20,6.13 R7.1 | J2.1 7.47,6.31 7.47,5.16 8.89,3.73 10.22,3.73 11.11,4.62 C5.2 11.2,4.62 11.2,6.67 R8.1 11.11,6.76 10.4,7.47 10.4,9.6 v10.13,9.87 | THERMAL.1 19.82,15.29 17.25,15.29 15.2,17.34 U$3.21 15.2,17.42 16.62,18.85 | 10.45,19.69 10.4,19.65 4.27,19.65 USB.5 | 10.45,19.69 11.2,20.45 11.65,20.45 R16.1 | 16.62,18.85 16.18,19.29 U$3.11 | 16.62,18.85 16.76,18.71 | 16.76,18.71 17.07,18.4 U$3.10 | v20.36,19.82 19.82,19.29 19.82,19.02 C3.1 | 16.76,18.71 v17.07,19.02 18.22,20.18 18.22,20.54 R9.1 | v14.58,20.98 13.87,21.69 13.87,21.96 R10.1 | U3.2 14.22,11.2 13.51,11.91 v13.42,11.91 | v10.49,19.65 10.45,19.69 | v17.51,12.36 17.42,12.27 17.34,12.27 17.29,12.22 | U$1.GND1 72.9,3.29 72.9,23.2 U$1.GND 72.81,23.2 v72.19,23.82 | 26.31,10.31 26.31,11.29 26.05,11.56 25.51,11.56 U2.9 25.43,11.56 24.8,11.56 23.91,10.67 v23.65,10.67 | 26.31,10.31 26.31,8.09 26.76,7.64 27.74,7.64 29.16,6.22 C6.1 | 29.38,9.29 28.36,10.31 26.31,10.31 | 29.38,9.29 29.43,9.25 29.43,8.62 U2.18 | 32,10.05 30.14,10.05 29.38,9.29 | 32,10.05 33.87,10.05 U2.25 | R22.2 40.89,17.87 40.89,17.51 41.96,16.45 U$4.7 42.05,16.36 42.76,15.65 42.85,15.65 43.03,15.47 43.03,13.42 42.85,13.25 39.92,13.25 37.52,15.65 35.47,15.65 | 28.32,16.31 28.45,16.45 U2.45 | 28.32,16.31 28.18,16.18 27.74,16.18 27.47,16.45 27.47,16.98 U2.47 | C2.1 33.87,19.11 34.67,18.31 C1.1 34.76,18.22 35.47,17.51 35.47,17.34
  Top 0.178: 35.47,17.34 35.47,15.65 | 35.47,15.65 35.47,15.47 34.58,14.58 33.96,14.58 U2.34 33.87,14.58 32,14.58 | v38.23,19.02 38.23,20.18 U5.2 | 35.47,17.34 v36.01,17.34 | 28.32,16.31 30.05,14.58 32,14.58 | 32,14.58 32,10.05
  Bottom 0.178: v20.36,19.82 17.87,19.82 v17.07,19.02 17.07,19.11 15.2,20.98 v14.58,20.98 12.89,20.98 11.02,19.11 | 10.13,10.05 9.96,10.05 9.6,10.4 9.6,17.69 11.02,19.11 | 10.13,10.05 11.11,10.05 12.98,11.91 v13.42,11.91 13.87,12.36 v17.51,12.36 20.71,12.36 22.4,10.67 v23.65,10.67 | 11.02,19.11 v10.49,19.65 | 10.13,10.05 v10.13,9.87 | v38.23,19.02 38.23,18.76 36.85,17.38 | 36.85,17.38 36.8,17.34 v36.01,17.34 | 50.01,24.23 50.05,24.18 50.05,23.65 48.98,22.58 45.96,22.58 39.38,16 37.6,16 37.56,16.05 | 50.01,24.23 49.25,24.98 46.76,24.98 46.23,24.45 44.98,24.45 U$2.18 | 37.56,16.05 36.89,16.71 36.89,17.34 36.85,17.38 | 37.56,16.05 37.16,15.65 37.16,9.51 45.07,1.6 U$5.18 | v72.19,23.82 54.76,23.82 54.05,24.54 50.32,24.54 50.01,24.23
GPIO_05  (via drill 0.3)
  Top 0.178: R1.1 19.82,11.65 19.02,10.85 19.02,8.89 20,7.91 R7.2 20.09,7.91 v21.07,7.91 | v47.74,21.96 47.74,19.11 48.27,18.58 49.43,18.58 51.47,20.62 58.14,20.62 60.72,23.2 U$1.P05
  Route2 0.178: v47.74,21.96 47.56,22.14 47.56,22.23 47.21,22.58 26.49,22.58 24.71,24.36 U$2.10
  Bottom 0.178: v21.07,7.91 21.78,7.91 24.8,10.94 24.8,17.16 23.02,18.94 23.02,22.76 24.62,24.36 U$2.10
N$1
  Top 0.178: R16.2 11.65,21.87 10.05,21.87 S1.3 9.78,22.05 6.13,22.05 S1.4
N$3  (via drill 0.3)
  Top 0.178: v52.9,19.65 67.21,19.65 70.76,23.2 71.39,23.2 U$1.RFOUT
  Route2 0.178: v52.9,19.65 49.25,23.29 43.56,23.29 42.49,24.36 U$2.17
N$4
  Top 0.178: U$1.P00 69.88,23.29 69.34,23.29 67.39,25.25 47.56,25.25 45.43,23.11 41.16,23.11 39.92,24.36 U$2.16
N$5  (via drill 0.3)
  Top 0.178: v61.16,20.27 64.81,20.27 67.74,23.2 68.28,23.2 U$1.P30
  Route2 0.178: v61.16,20.27 54.41,20.27 53.16,19.02 52.63,19.02 50.94,20.71 50.94,21.07 49.07,22.94 38.76,22.94 37.34,24.36 U$2.15
N$8
  Top 0.178: R26.1 23.38,13.51 25.43,13.51 U2.5
N$9
  Top 0.178: U$1.P03 63.74,23.2 63.21,23.2 60.27,20.27 51.83,20.27 49.25,17.69 48.18,17.69 43.12,22.76 31.38,22.76 29.78,24.36 U$2.12
N$10  (via drill 0.3)
  Top 0.178: v50.32,20.8 50.49,20.98 57.96,20.98 59.92,22.94 59.92,23.38 60.54,24 60.98,24 61.7,23.29 62.23,23.29 U$1.P04 | v29.6,21.87 27.11,24.36 U$2.11
  Route2 0.178: v50.32,20.8 36.89,20.8 35.47,22.23 29.96,22.23 v29.6,21.87
N$11
  Top 0.178: R4.1 10.58,12.89 11.29,12.89 12.71,11.47 12.71,8.62 13.25,8.09 U3.4
N$13  (via drill 0.3)
  Top 0.178: v48.36,24.27 48.63,24.54 57.43,24.54 58.67,23.29 59.21,23.29 U$1.P06
  Route15 0.178: v48.36,24.27 46.23,22.14 31.83,22.14 30.58,20.89 26.23,20.89 22.76,24.36 22.14,24.36 U$2.9
N$14  (via drill 0.3)
  Top 0.178: v49.16,19.2 49.16,20.54 50.05,21.43 55.38,21.43 57.16,23.2 57.7,23.2 U$1.P07/TX
  Route2 0.178: v49.16,19.2 48.54,18.58 44.9,18.58 41.34,15.02 32.98,15.02 29.25,11.29 19.29,11.29 19.11,11.11 18.58,11.11 18.22,11.47 18.22,15.56 19.29,16.62 19.29,24.09 19.56,24.36 U$2.8
N$15  (via drill 0.3)
  Top 0.178: v49.16,21.78 54.14,21.78 55.56,23.2 56.19,23.2 U$1.P08
  Route15 0.178: v49.16,21.78 48.45,21.78 48.01,21.34 36.36,21.34 35.92,21.78 32,21.78 30.67,20.45 21.96,20.45 18.05,24.36 17.07,24.36 U$2.7
N$16  (via drill 0.3)
  Top 0.178: v53.78,22.49 54.5,23.2 54.67,23.2 U$1.P09
  Route15 0.178: v53.78,22.49 53.43,22.49 52.36,21.43 49.7,21.43 48.98,20.71 36.09,20.71 35.47,20.09 34.67,20.09 34.4,20.36 31.11,20.36 30.85,20.09 21.78,20.09 18.58,23.29 15.91,23.29 14.85,24.36 14.49,24.36 U$2.6
N$17  (via drill 0.3)
  Top 0.178: v52.01,22.4 52.81,23.2 53.07,23.2 U$1.P10
  Route15 0.178: v52.01,22.4 52.81,22.4 53.52,23.11 54.05,23.11 54.41,22.76 54.41,22.23 52.81,20.62 51.03,20.62 50.58,20.18 48.98,20.18 48.81,20.36 36.72,20.36 35.2,18.85 30.49,18.85 29.6,19.74 21.6,19.74 18.76,22.58 16.09,22.58 15.38,23.29 13.07,23.29 12,24.36 U$2.5
N$18  (via drill 0.3)
  Top 0.178: v53.87,23.82 53.7,24 52.9,24 52.18,23.29 51.65,23.29 U$1.P11
  Route15 0.178: v53.87,23.82 54.76,22.94 54.76,22.05 52.98,20.27 51.21,20.27 50.76,19.82 48.81,19.82 48.63,20 36.89,20 35.38,18.49 30.32,18.49 29.6,19.2 18.94,19.2 15.2,22.94 12,22.94 11.65,23.29 10.49,23.29 U$2.4
N$19  (via drill 0.3)
  Top 0.178: v49.43,23.91 50.05,23.29 U$1.P12
  Route15 0.178: v37.87,16.62 27.91,16.62 25.69,18.85 18.76,18.85 15.02,22.58 11.82,22.58 11.47,22.94 8.36,22.94 6.93,24.36 U$2.3
  Bottom 0.178: v49.43,23.91 48.9,23.91 47.92,22.94 45.78,22.94 39.47,16.62 v37.87,16.62
N$20  (via drill 0.3)
  Top 0.178: v48.36,19.38 48.54,19.56 48.54,23.2 U$1.P13
  Route15 0.178: v48.36,19.38 46.49,19.38 43.47,16.36 39.47,16.36 38.94,15.82 31.11,15.82 30.67,15.38 28.63,15.38 27.56,16.45 26.58,16.45 26.23,16.09 20.18,16.09 18.05,18.22 15.65,18.22 11.29,22.58 6.13,22.58 4.36,24.36 U$2.2
N$21  (via drill 0.3)
  Top 0.178: v46.94,21.96 47.03,22.05 47.03,23.2 U$1.P14
  Route15 0.178: v37.78,14.4 35.56,14.4 35.47,14.49 28.89,14.49 28.36,13.96 21.78,13.96 20.09,15.65 17.69,15.65 11.11,22.23 3.91,22.23 1.78,24.36 U$2.1
  Bottom 0.178: v46.94,21.96 45.87,21.96 38.32,14.4 v37.78,14.4
N$25  (1 unrouted)
N$26
  Top 0.178: U$1.SOP0 66.76,3.2 66.23,3.2 64.99,1.96 56.45,1.96 56.1,1.6 46.76,1.6 45.61,2.76 36.09,2.76 34.94,1.6 U$5.14
N$27  (via drill 0.3)
  Top 0.178: v44.63,10.58 57.43,10.58 64.72,3.29 65.25,3.29 U$1.P31/RX
  Route15 0.178: v44.63,10.58 29.25,10.58 25.07,6.4 24,6.4 v23.47,5.87
  Bottom 0.178: v23.47,5.87 23.47,4.98 25.34,3.11 30.85,3.11 32.36,1.6 U$5.13
N$29  (via drill 0.3)
  Top 0.178: v58.32,2.58 61.07,2.58 61.7,3.2 62.23,3.2 U$1.P27
  Route15 0.178: v58.32,2.58 55.65,2.58 54.85,1.78 46.85,1.78 45.7,2.93 28.71,2.93 27.38,1.6 U$5.11
N$30  (via drill 0.3)
  Top 0.178: v43.2,6.67 46.23,6.67 46.58,6.31 57.16,6.31 60.19,3.29 60.72,3.29 U$1.P26 | v24.27,5.78 24.45,5.78 24.98,5.25 24.98,1.78 24.8,1.6 U$5.10
  Route2 0.178: v43.2,6.67 31.2,6.67 30.32,5.78 v24.27,5.78
N$31  (via drill 0.3)
  Top 0.178: v42.41,5.16 42.58,5.16 43.65,6.22 46.14,6.22 46.41,5.96 56.01,5.96 58.67,3.29 59.21,3.29 U$1.P29/TMS | v24.36,4.98 24.36,3.73 22.23,1.6 U$5.9
  Route2 0.178: v42.41,5.16 24.54,5.16 v24.36,4.98
N$32  (via drill 0.3)
  Top 0.178: v47.38,2.4 47.83,1.96 55.92,1.96 57.16,3.2 57.7,3.2 U$1.P19/TCK
  Route2 0.178: v47.38,2.4 46.76,2.4 45.87,3.29 21.43,3.29 19.74,1.6 U$5.8
N$33  (via drill 0.3)
  Top 0.178: v44.63,5.07 45.43,5.87 45.96,5.87 46.23,5.6 53.34,5.6 55.65,3.29 56.19,3.29 U$1.P28
  Route2 0.178: v44.63,5.07 44.27,5.07 42.85,3.65 19.2,3.65 17.16,1.6 U$5.7
N$34  (via drill 0.3)
  Top 0.178: v45.7,5.25 52.18,5.25 54.14,3.29 54.67,3.29 U$1.P24/TDO
  Route2 0.178: v45.7,5.25 45.34,5.25 44.9,5.69 44.36,5.69 42.67,4 17.07,4 14.67,1.6 U$5.6
N$35  (via drill 0.3)
  Top 0.178: v47.21,4.62 47.47,4.89 51.03,4.89 52.63,3.29 53.07,3.29 U$1.P23/TDI
  Route2 0.178: v47.21,4.62 45.7,6.13 44.27,6.13 42.49,4.36 14.85,4.36 12.09,1.6 U$5.5
N$36  (via drill 0.3)
  Top 0.178: v48.45,4.27 50.14,4.27 51.12,3.29 51.56,3.29 U$1.P22
  Route2 0.178: v48.45,4.27 45.52,7.2 43.56,7.2 43.47,7.29 15.29,7.29 9.6,1.6 U$5.4
N$37  (via drill 0.3)
  Top 0.178: v49.43,2.58 50.05,3.2 U$1.P17
  Route15 0.178: v49.43,2.58 48.09,2.58 47.38,3.29 8.71,3.29 7.02,1.6 U$5.3
N$38  (via drill 0.3)
  Top 0.178: v23.65,21.07 23.2,20.62 23.2,20.27 Y1.3 | v29.52,16 29.52,16.98 U2.43 | v34.14,19.74 33.52,20.36 33.25,20.36 C2.2
  Bottom 0.178: v23.65,21.07 24.27,21.07 26.58,18.76 30.05,18.76 30.36,18.45 | 30.36,18.45 30.4,18.4 30.4,16.89 v29.52,16 | v34.14,19.74 31.65,19.74 30.36,18.45
N$39  (via drill 0.3)
  Top 0.178: v27.38,21.51 26.94,21.07 26.94,20 26.23,19.29 R27.1 | v39.12,19.02 38.32,18.22 38.32,17.78 U5.5 | v26.85,15.82 26.94,15.91 26.94,16.98 U2.48
  Route2 0.178: v26.85,15.82 25.96,15.82 25.34,16.45 25.34,19.47 v27.38,21.51
  Bottom 0.178: v27.38,21.51 26.85,20.98 26.31,20.98 25.96,21.34 25.96,21.87 26.58,22.49 35.65,22.49 v39.12,19.02
N$40  (via drill 0.3)
  Top 0.178: C3.2 19.82,17.69 20.27,17.69 21.51,18.94 Y1.1 21.6,18.85 22.31,18.14 v24.71,18.14 | v28.89,18.14 28.89,17.07 U2.44
  Bottom 0.178: v24.71,18.14 v28.89,18.14
N$41  (via drill 0.3)
  Top 0.178: v34.94,20.71 35.47,20.18 35.83,20.18 R30.1 | v36.54,17.96 37.07,17.96 37.25,17.78 U5.4 | v25.96,16.71 25.51,16.27 25.51,15.65 U2.1
  Route2 0.178: v25.96,16.71 26.58,16.71 30.58,20.71 v34.94,20.71
  Bottom 0.178: v34.94,20.71 34.94,20.36 36.54,18.76 v36.54,17.96
N$42  (via drill 0.3)
  Top 0.178: v29.78,18.14 29.07,18.85 29.07,19.11 R32.1 | v27.65,15.47 27.38,15.47 27.03,15.11 25.51,15.11 U2.2 | v37.16,19.02 37.25,19.11 37.25,20.18 U5.3
  Route2 0.178: v37.16,19.02 35.38,19.02 34.49,18.14 v29.78,18.14
  Bottom 0.178: v29.78,18.14 29.78,17.6 v27.65,15.47
N$43  (via drill 0.3)
  Top 0.178: v32.27,15.2 33.96,16.89 34.67,16.89 C1.2 | v30.94,13.87 26.85,13.87 26.05,13.07 25.51,13.07 U2.6
  Bottom 0.178: v30.94,13.87 v32.27,15.2
N$44
  Top 0.178: R17.2 30.4,19.11 30.4,18.22 30.94,17.69 30.94,17.07 U2.40
N$45
  Top 0.178: R6.2 31.65,19.11 31.65,17.87 31.47,17.69 31.47,17.07 U2.39
N$46
  Top 0.178: R20.2 38.94,5.6 38.58,5.6 37.96,4.98 35.29,4.98 32.45,7.82 32.45,8.53 U2.24
N$47
  Top 0.178: R19.2 37.52,7.02 37.52,8.18 37.69,8.36 37.69,9.16 37.43,9.42 30.23,9.42 29.96,9.16 29.96,8.62 U2.19
N$48
  Top 0.178: R18.2 31.38,6.4 30.94,6.4 29.69,7.64 29.25,7.64 28.98,7.91 28.98,8.53 U2.17
N$49
  Top 0.178: R22.1 40.8,19.2 40.09,18.49 40.09,15.56 41.78,13.87 41.96,13.87 U$4.5
N$50  (via drill 0.3)
  Top 0.178: v43.2,18.4 42.32,19.29 R21.1 | v40.89,15.73 41.34,15.73 41.96,15.11 U$4.6
  Bottom 0.178: v43.2,18.4 43.2,18.05 v40.89,15.73
N$51  (via drill 0.3)
  Top 0.178: v30.05,6.4 30.05,5.87 29.6,5.42 28.8,5.42 28.09,6.13 27.91,6.13 C6.2 | v26.14,17.51 26.14,17.69 27.07,18.62 | 27.07,18.62 27.65,19.2 R25.2 | 27.07,18.62 27.91,17.78 27.91,17.07 U2.46
  Bottom 0.178: v30.05,6.4 30.05,11.73 26.23,15.56 26.23,16.09 26.58,16.45 26.58,17.07 v26.14,17.51
N$52  (via drill 0.3)
  Top 0.178: v45.52,4 47.3,4 48.01,3.29 48.54,3.29 U$1.P16
  Route15 0.178: v45.52,4 44.98,4 44.63,3.65 6.49,3.65 4.45,1.6 U$5.2
N$53  (via drill 0.3)
  Top 0.178: v44.36,4.27 45.34,3.29 47.03,3.29 U$1.P15
  Route15 0.178: v44.36,4.27 4.62,4.27 1.96,1.6 U$5.1
N$54  (via drill 0.3)
  Top 0.178: 28.54,21.25 28.98,20.8 28.98,20.54 R32.2 | 28.54,21.25 27.56,22.23 26.31,22.23 25.43,21.34 25.43,20.27 24.62,19.47 R31.1 | v35.65,21.16 38.58,21.16 39.12,20.62 39.12,20.27 U5.1 | 28.54,21.25 v28.8,21.51
  Bottom 0.178: v35.65,21.16 35.38,21.16 35.2,21.34 31.03,21.34 30.67,20.98 29.34,20.98 v28.8,21.51
N$55
  Top 0.178: R33.2 25.43,8.62 25.43,8.98 24.54,9.87 24.54,10.76 24.8,11.02 25.43,11.02 U2.10
N$56
  Top 0.178: R34.2 40.8,6.93 41.6,6.93 43.03,8.36 43.03,10.4 42.85,10.58 33.96,10.58 U2.26
N$68
  Top 0.178: U$3.12 15.65,19.38 15.65,19.74 18.22,22.31 R9.2
N$69
  Top 0.178: U$3.13 15.2,19.38 15.2,21.69 15.47,21.96 R10.2
N$70  (via drill 0.3)
  Top 0.178: v17.96,16.27 17.16,16.27 U$3.6 | v10.49,15.73 8.09,15.73 6.93,14.58 PWR.A
  Route2 0.178: v17.96,16.27 11.02,16.27 v10.49,15.73
N$71  (via drill 0.3)
  Top 0.178: v19.91,20.54 19.91,20.27 19.02,19.38 19.02,18.22 17.69,16.89 17.16,16.89 U$3.7 | v5.96,17.07 6.58,17.07 6.84,16.8 DONE.A
  Bottom 0.178: v19.91,20.54 16.18,20.54 15.11,21.6 8.09,21.6 5.96,19.47 v5.96,17.07
N$72
  Top 0.178: U$3.8 17.16,17.34 17.6,17.34 18.67,18.4 18.67,19.56 19.11,20 19.11,22.94 18.94,23.11 13.51,23.11 12.54,22.14 12.54,18.85 11.56,17.87 8,17.87 7.2,18.67 6.93,18.67 CHRG.A
N$73
  Top 0.178: CHRG.C 8.45,18.67 9.69,18.67 R35.1
N$74
  Top 0.178: DONE.C 8.45,16.71 9.69,16.71 R11.1
N$75
  Top 0.178: PWR.C 8.45,14.49 9.69,14.49 R12.1
N$76
  Top 0.178: U$3.2 14.58,15.29 14.58,14.22 14.94,13.87 15.47,13.87 15.82,14.22 17.34,14.22 18.14,13.42 R15.2 18.22,13.34 18.94,12.62 20.36,12.62 20.71,12.27 20.71,10.49 22.14,9.07 22.14,8.8 R14.1
N$77
  Top 0.178: U$3.5 16.18,15.29 16.71,15.29 17.42,14.58 18.85,14.58 19.82,13.6 THERMAL.2
OUT
  Top 0.178: R3.1 11.11,11.56 10.67,11.56 9.34,12.89 R4.2 9.34,12.98 10.05,13.69 13.16,13.69 | U$3.20 13.25,16.27 U$3.1 14.05,15.29 13.16,14.4 13.16,13.69 | 13.16,13.69 13.16,12.98 C4.1 13.25,12.98 14.05,12.18 16.8,12.18 17.51,11.47 17.51,10.67 15.2,8.36 15.2,8.09 U3.5
RST  (via drill 0.3)
  Top 0.178: 49.07,9.96 44.36,9.96 43.74,10.58 43.74,16.54 42.32,17.96 R21.2 | 49.07,9.96 56.54,9.96 63.21,3.29 63.74,3.29 U$1.RESET | v8.36,12.09 9.07,11.38 R5.1 | v7.64,20.27 6.31,20.27 6.13,20.45 S1.2 | v49.07,6.93 49.07,9.96
  Route2 0.178: v49.07,6.93 49.07,3.2 47.65,1.78 46.85,1.78 45.7,2.93 31.2,2.93 29.87,1.6 U$5.12
  Bottom 0.178: v7.64,20.27 8.36,19.56 v8.36,12.09 8.36,7.11 12.71,2.76 27.83,2.76 28.98,1.6 29.78,1.6 U$5.12
SOP2  (via drill 0.3)
  Top 0.178: v56.72,1.33 56.98,1.6 67.65,1.6 69.25,3.2 69.88,3.2 U$1.P25/SOP2 | v33.69,2.31 33.25,2.76 28.18,2.76 24,6.93 24,7.11 R23.2
  Route2 0.178: v33.69,2.31 34.23,2.31 34.49,2.58 38.94,2.58 39.92,1.6 U$5.16
  Route15 0.178: v56.72,1.33 46.76,1.33 45.52,2.58 40.98,2.58 40.01,1.6 U$5.16
SW
  Top 0.178: D3.C 16.71,11.02 15.38,11.02 15.2,10.85 U3.1 15.11,10.76 15.11,10.31 14.49,9.69 14.49,5.51 13.6,4.62 13.6,4.36 L1.1
TCK
  Top 0.178: R23.1 24,8.45 24.71,7.73 24.71,6.76 27.2,4.27 40.63,4.27 42.58,6.22 42.58,7.38 43.38,8.18 43.38,10.58 42.76,11.2 42.05,11.2 U$4.3
USB_D+  (via drill 0.3)
  Top 0.178: v18.58,16.8 21.34,16.8 23.2,14.94 R28.2 | v7.29,17.69 5.42,17.69 4.89,18.22 4.27,18.22 USB.3
  Route2 0.178: v18.58,16.8 18.31,16.8 17.42,17.69 v7.29,17.69
USB_D-
  Top 0.178: R29.2 22.05,12.09 23.02,11.11 23.02,7.64 18.76,3.38 7.2,3.38 4.8,5.78 4.8,13.6 5.25,14.05 5.25,17.25 4.89,17.6 4.27,17.6 USB.2
USB_DM
  Top 0.178: R29.1 23.38,12.09 25.43,12.09 U2.8
USB_DP  (via drill 0.3)
  Top 0.178: 22.05,13.69 22.05,13.51 R26.2 22.05,13.69 | 22.05,13.69 22.05,14.85 R28.1 | v24.18,12.8 24.36,12.62 25.43,12.62 U2.7 | 22.05,13.69 v21.16,13.69
  Bottom 0.178: v24.18,12.8 22.05,12.8 v21.16,13.69
VCC  (via drill 0.3)
  Top 0.178: 35.07,19.6 34.76,19.91 34.76,20 34.31,20.45 34.31,20.98 35.12,21.78 38.94,21.78 39.83,20.89 39.83,18.76 39.2,18.14 39.2,17.78 U5.6 | 35.07,19.6 35.83,18.85 R30.2 | 10.05,6.04 10.05,5.07 9.6,4.62 C5.1 | 10.05,6.04 10.05,9.07 9.16,9.96 R5.2 | L1.2 15.29,4.36 15.2,4.45 15.2,6.04 R13.2 15.29,6.04 15.96,6.71 | 15.96,6.71 16.18,6.93 16.98,6.93 C7.1 | 35.96,8.13 36.54,8.71 U$4.14 | 35.96,8.13 35.92,8.09 35.92,7.02 R24.1 | v57.52,0.98 68.54,0.98 70.76,3.2 71.39,3.2 U$1.VCC | v26.31,6.4 25.51,7.2 R33.1 | v24.62,21.6 24.62,20.71 R31.2 | v26.58,21.6 26.23,21.25 26.23,20.62 R27.2 | v27.47,9.69 27.47,8.62 U2.14 | v35.03,13.07 U2.31 | v35.38,8.71 35.96,8.13 | v16,6.67 15.96,6.71 | v10.31,6.04 10.05,6.04 | v34.94,19.47 35.07,19.6
  Route2 0.178: v57.52,0.98 57.25,0.98 56.98,0.71 47.38,0.71 45.52,2.58 43.56,2.58 42.58,1.6 U$5.17
  Bottom 0.178: 27.47,6.4 29.16,6.4 30.09,5.47 | 27.47,6.4 v26.31,6.4 26.05,6.67 v16,6.67 15.38,6.04 v10.31,6.04 | 30.09,5.47 32.63,2.93 41.16,2.93 42.49,1.6 U$5.17 | v24.62,21.6 25.16,21.6 26.4,20.36 28,20.36 | 28,20.36 34.4,20.36 34.76,20 34.76,19.47 | 34.76,13.07 34.76,10.13 34.36,9.73 | 34.76,13.07 34.76,19.47 | 30.09,5.47 34.36,9.73 | v26.58,21.6 27.11,22.14 27.65,22.14 28,21.78 28,20.36 | 27.47,6.4 v27.47,9.69 | 34.76,13.07 v35.03,13.07 | 34.36,9.73 v35.38,8.71 | 34.76,19.47 v34.94,19.47